# Altium project Gen_Ai_Kbd.PrjPcb (part 3 of 3)

## Sheet uController_n_Ethernet.SchDoc
size 594 x 420 mm; SheetNumber: 9; SheetTotal: 11; SPICEModelCacheEHICLKKR: <root> / <DocumentId>EHICLKKR</DocumentId> / <CacheFrame Number="0"> / <Model Name="0603_885012206095_100nf" Kind="CKT"> / <Text>******* / .subckt 0603_885012206095_100nF 1 2 / Rser 1 3 0.0157659152881 / Lser 2 4 3.10171966E-10 / C1 3 4 0.0000001 / Rpar 3 4 5000000000 / .ends 0603_885012206095_100nF</Text> / </Model> / <Model Name="0603_885012106006_10uf" Kind="CKT"> / <Text>******* / .subckt 0603_885012106006_10uF 1 2 / Rser 1 3 0.00407641026021 / Lser 2 4 4.16060333E-10 / C1 3 4 0.00001 / Rpar 3 4 5000000 / .ends 0603_885012106006_10uF</Text> / </Model> / </CacheFrame> / </root>
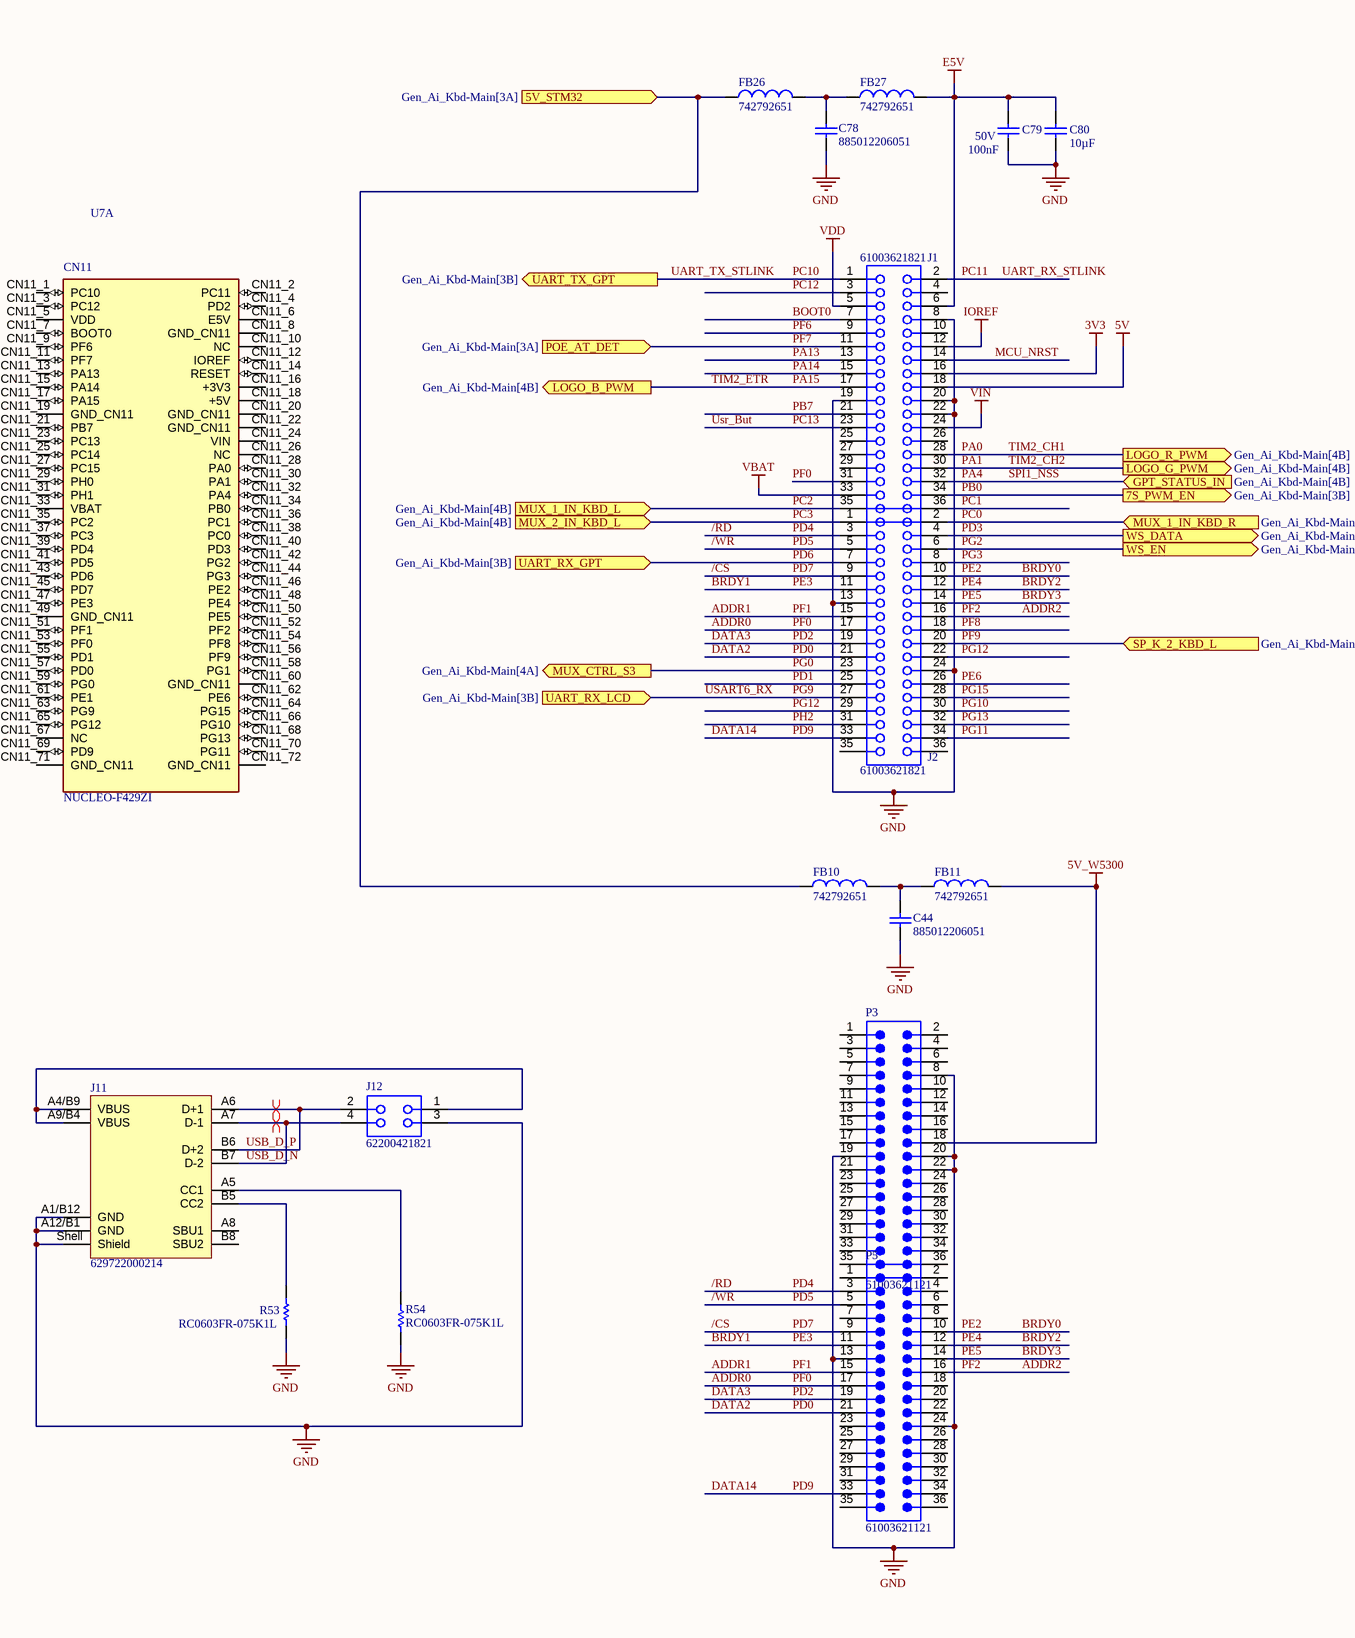
[diagram p8: uController_n_Ethernet.SchDoc, left]
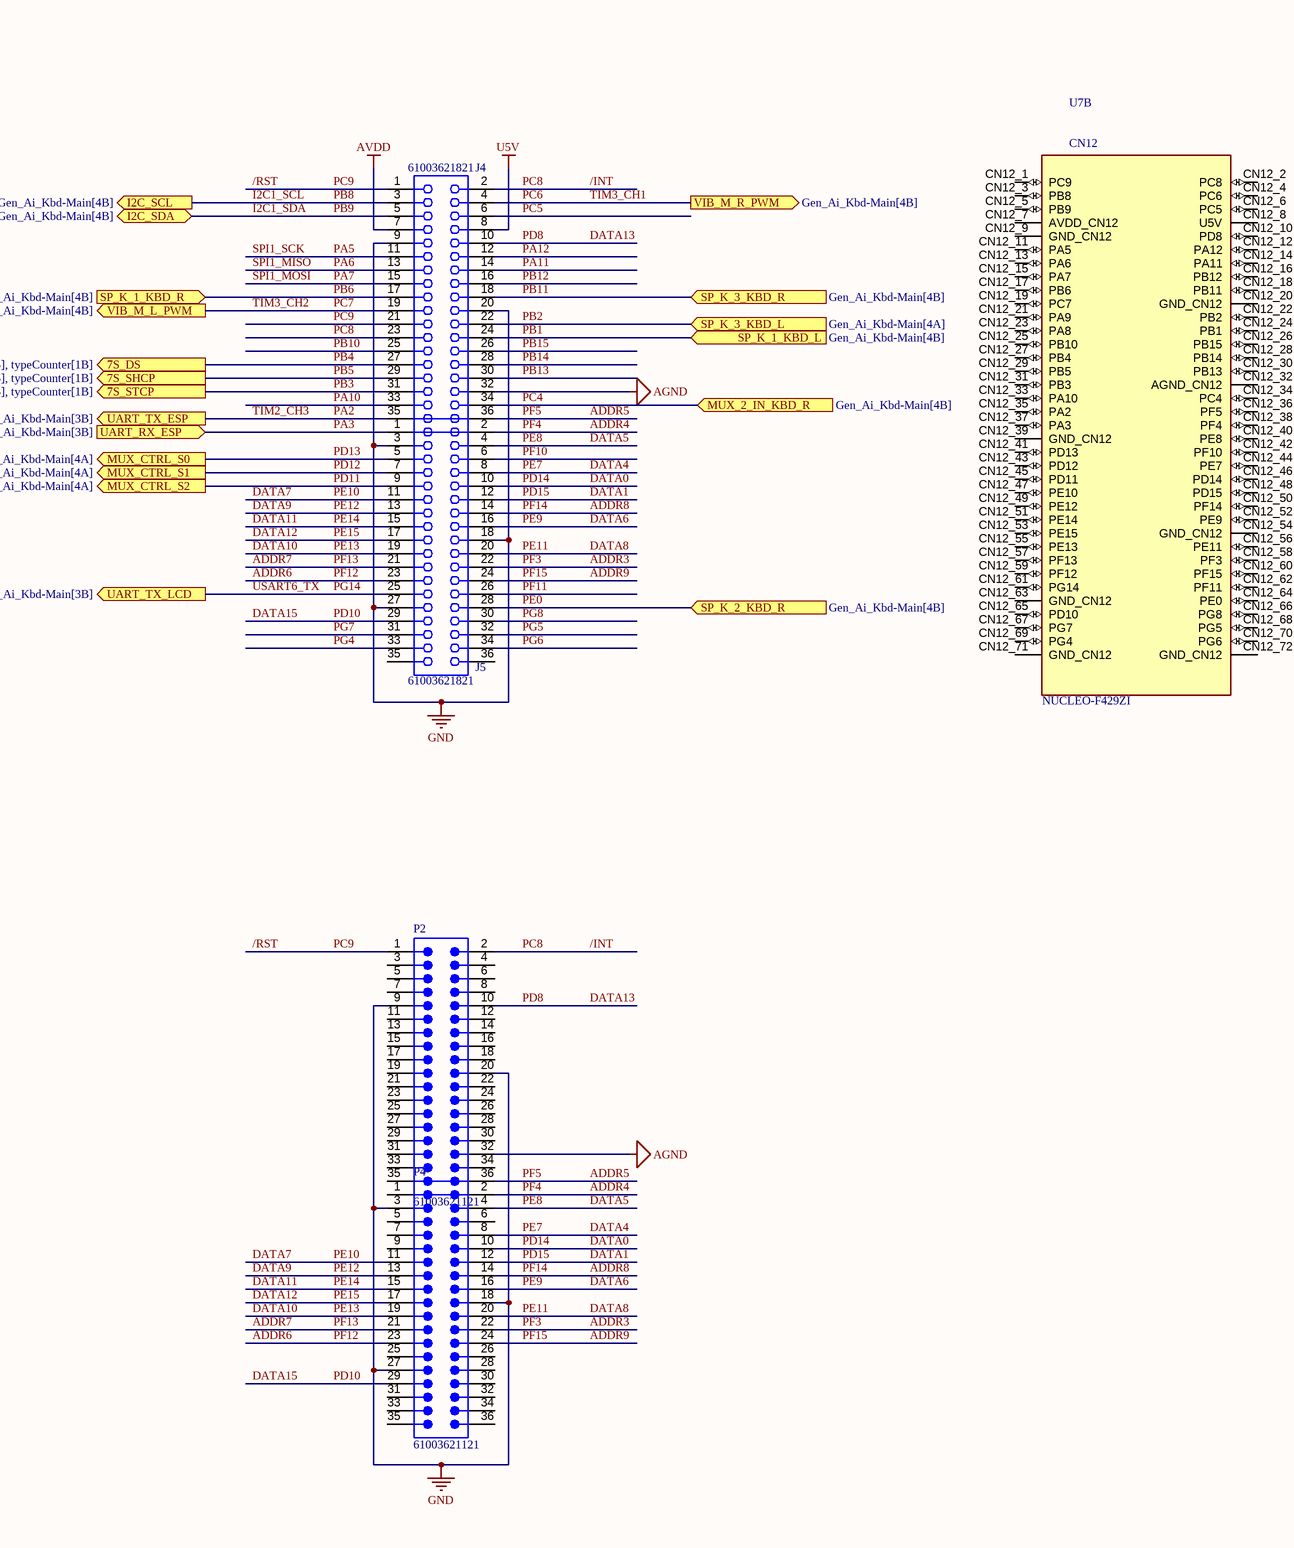
[diagram p9: uController_n_Ethernet.SchDoc, right]

### Parts
C44  885012206051  [WCAP-CSGP_0603_L1.6W0.8H0.8_Reflow]
C78  885012206051  [WCAP-CSGP_0603_L1.6W0.8H0.8_Reflow]
C79  Capacitance: 100nF  Rated Voltage (DC): 50V  [WCAP-CSGP_0603_L1.6W0.8H0.8_Reflow]  (hidden comment: 885012206095)
C80  Capacitance: 10µF  [WCAP-CSGP_0603_L1.6W0.8H0.8_Reflow]  (hidden comment: 885012106006)
FB10  742792651  [WE-CBF_0603_L1.6W0.8H0.8_HC]
FB11  742792651  [WE-CBF_0603_L1.6W0.8H0.8_HC]
FB26  742792651  [WE-CBF_0603_L1.6W0.8H0.8_HC]
FB27  742792651  [WE-CBF_0603_L1.6W0.8H0.8_HC]
J1  61003621821  [61003621821]
J2  61003621821  [61003621821]
J4  61003621821  [61003621821]
J5  61003621821  [61003621821]
J11  629722000214  [629722000214]
J12  62200421821  [62200421821]
P2  61003621121  [61003621121]
P3  61003621121  [61003621121]
P4  61003621121  [61003621121]
P5  61003621121  [61003621121]
R53  RC0603FR-075K1L  [RESC1608X55X25ML10T15]
R54  RC0603FR-075K1L  [RESC1608X55X25ML10T15]
U7  NUCLEO-F429ZI  [MODULE_NUCLEO-F429ZI]  (parts A,B of 6)

### Ports
5V_STM32 (in, see Gen_Ai_Kbd-Main[3A]), 7S_DS (out, see Gen_Ai_Kbd-Main[3B], typeCounter[1B]), 7S_PWM_EN (out, see Gen_Ai_Kbd-Main[3B]), 7S_SHCP (out, see Gen_Ai_Kbd-Main[3B], typeCounter[1B]), 7S_STCP (out, see Gen_Ai_Kbd-Main[3B], typeCounter[1B]), GPT_STATUS_IN (in, see Gen_Ai_Kbd-Main[4B]), I2C_SCL (out, see Gen_Ai_Kbd-Main[4B]), I2C_SDA (bidir, see Gen_Ai_Kbd-Main[4B]), LOGO_B_PWM (out, see Gen_Ai_Kbd-Main[4B]), LOGO_G_PWM (out, see Gen_Ai_Kbd-Main[4B]), LOGO_R_PWM (out, see Gen_Ai_Kbd-Main[4B]), MUX_1_IN_KBD_L (in, see Gen_Ai_Kbd-Main[4B]), MUX_1_IN_KBD_R (in, see Gen_Ai_Kbd-Main[4B]), MUX_2_IN_KBD_L (in, see Gen_Ai_Kbd-Main[4B]), MUX_2_IN_KBD_R (in, see Gen_Ai_Kbd-Main[4B]), MUX_CTRL_S0 (out, see Gen_Ai_Kbd-Main[4A]), MUX_CTRL_S1 (out, see Gen_Ai_Kbd-Main[4A]), MUX_CTRL_S2 (out, see Gen_Ai_Kbd-Main[4A]), MUX_CTRL_S3 (out, see Gen_Ai_Kbd-Main[4A]), POE_AT_DET (in, see Gen_Ai_Kbd-Main[3A]), SP_K_1_KBD_L (in, see Gen_Ai_Kbd-Main[4B]), SP_K_1_KBD_R (in, see Gen_Ai_Kbd-Main[4B]), SP_K_2_KBD_L (in, see Gen_Ai_Kbd-Main[4A]), SP_K_2_KBD_R (in, see Gen_Ai_Kbd-Main[4B]), SP_K_3_KBD_L (in, see Gen_Ai_Kbd-Main[4A]), SP_K_3_KBD_R (in, see Gen_Ai_Kbd-Main[4B]), UART_RX_ESP (in, see Gen_Ai_Kbd-Main[3B]), UART_RX_GPT (in, see Gen_Ai_Kbd-Main[3B]), UART_RX_LCD (in, see Gen_Ai_Kbd-Main[3B]), UART_TX_ESP (out, see Gen_Ai_Kbd-Main[3B]), UART_TX_GPT (out, see Gen_Ai_Kbd-Main[3B]), UART_TX_LCD (out, see Gen_Ai_Kbd-Main[3B]), VIB_M_L_PWM (out, see Gen_Ai_Kbd-Main[4B]), VIB_M_R_PWM (out, see Gen_Ai_Kbd-Main[4B]), WS_DATA (out, see Gen_Ai_Kbd-Main[3B]), WS_EN (out, see Gen_Ai_Kbd-Main[3B])

### Nets
3V3: J1.16
5V: J1.18
5V_W5300: FB11.2 P3.18
+5V_GLOBAL_BUS: FB10.1 FB26.1 ; port 5V_STM32
AGND: J4.32 P2.32
AVDD: J4.7
E5V: C79.2 C80.2 FB27.2 J1.6
GND: C44.1 C78.1 C79.1 C80.1 J1.8 J1.19 J1.20 J1.22 J2.13 J2.24 J4.9 J4.20 J5.3 J5.18 J5.27 J11.A1/B12(GND) J11.A12/B1(GND) J11.Shell(Shield) J12.3 P2.9 P2.20 P3.8 P3.19 P3.20 P3.22 P4.3 P4.18 P4.27 P5.13 P5.24 R53.1 R54.1
IOREF: J1.12
U5V: J4.8
VBAT: J1.33
VDD: J1.5
VIN: J1.24
/CS: J2.9 P5.9  [also labelled PD7]
/INT: J4.2 J4.23 P2.2  [also labelled PC8]
/RD: J2.3 P5.3  [also labelled PD4]
/RST: J4.1 J4.21 P2.1  [also labelled PC9]
/WR: J2.5 P5.5  [also labelled PD5]
ADDR0: J1.31 J2.17 P5.17  [also labelled PF0]
ADDR1: J2.15 P5.15  [also labelled PF1]
ADDR2: J2.16 P5.16  [also labelled PF2]
ADDR3: J5.22 P4.22  [also labelled PF3]
ADDR4: J5.2 P4.2  [also labelled PF4]
ADDR5: J4.36 P2.36  [also labelled PF5]
ADDR6: J5.23 P4.23  [also labelled PF12]
ADDR7: J5.21 P4.21  [also labelled PF13]
ADDR8: J5.14 P4.14  [also labelled PF14]
ADDR9: J5.24 P4.24  [also labelled PF15]
BOOT0: J1.7
BRDY0: J2.10 P5.10  [also labelled PE2]
BRDY1: J2.11 P5.11  [also labelled PE3]
BRDY2: J2.12 P5.12  [also labelled PE4]
BRDY3: J2.14 P5.14  [also labelled PE5]
DATA0: J5.10 P4.10  [also labelled PD14]
DATA1: J5.12 P4.12  [also labelled PD15]
DATA2: J2.21 P5.21  [also labelled PD0]
DATA3: J2.19 P5.19  [also labelled PD2]
DATA4: J5.8 P4.8  [also labelled PE7]
DATA5: J5.4 P4.4  [also labelled PE8]
DATA6: J5.16 P4.16  [also labelled PE9]
DATA7: J5.11 P4.11  [also labelled PE10]
DATA8: J5.20 P4.20  [also labelled PE11]
DATA9: J5.13 P4.13  [also labelled PE12]
DATA10: J5.19 P4.19  [also labelled PE13]
DATA11: J5.15 P4.15  [also labelled PE14]
DATA12: J5.17 P4.17  [also labelled PE15]
DATA13: J4.10 P2.10  [also labelled PD8]
DATA14: J2.33 P5.33  [also labelled PD9]
DATA15: J5.29 P4.29  [also labelled PD10]
I2C1_SCL: J4.3 ; port I2C_SCL  [also labelled PB8]
I2C1_SDA: J4.5 ; port I2C_SDA  [also labelled PB~{9}]
MCU_NRST: J1.14
PA0: J1.28 ; port LOGO_R_PWM  [also labelled TIM2_CH1]
PA1: J1.30 ; port LOGO_G_PWM  [also labelled TIM2_CH2]
PA2: J4.35 ; port UART_TX_ESP  [also labelled TIM2_CH3]
PA3: J5.1 ; port UART_RX_ESP
PA4: J1.32 ; port GPT_STATUS_IN  [also labelled SPI1_NSS]
PA5: J4.11  [also labelled SPI1_SCK]
PA6: J4.13  [also labelled SPI1_MISO]
PA7: J4.15  [also labelled SPI1_MOSI]
PA10: J4.33
PA11: J4.14
PA12: J4.12
PA13: J1.13
PA14: J1.15
PA15: J1.17 ; port LOGO_B_PWM  [also labelled TIM2_ETR]
PB0: J1.34 ; port 7S_PWM_EN
PB1: J4.24 ; port SP_K_1_KBD_L
PB2: J4.22 ; port SP_K_3_KBD_L
PB3: J4.31 ; port 7S_STCP
PB4: J4.27 ; port 7S_DS
PB5: J4.29 ; port 7S_SHCP
PB6: J4.17 ; port SP_K_1_KBD_R
PB7: J1.21
PB10: J4.25
PB11: J4.18 ; port SP_K_3_KBD_R
PB12: J4.16
PB13: J4.30
PB14: J4.28
PB15: J4.26
PC0: J2.2 ; port MUX_1_IN_KBD_R
PC1: J1.36
PC2: J1.35 ; port MUX_1_IN_KBD_L
PC3: J2.1 ; port MUX_2_IN_KBD_L
PC4: J4.34 ; port MUX_2_IN_KBD_R
PC5: J4.6
PC6: J4.4 ; port VIB_M_R_PWM  [also labelled TIM3_CH1]
PC7: J4.19 ; port VIB_M_L_PWM  [also labelled TIM3_CH2]
PC10: J1.1 ; port UART_TX_GPT  [also labelled UART_TX_STLINK]
PC11: J1.2  [also labelled UART_RX_STLINK]
PC12: J1.3
PC13: J1.23  [also labelled Usr_But]
PD1: J2.25
PD3: J2.4 ; port WS_DATA
PD6: J2.7 ; port UART_RX_GPT
PD11: J5.9 ; port MUX_CTRL_S2
PD12: J5.7 ; port MUX_CTRL_S1
PD13: J5.5 ; port MUX_CTRL_S0
PE0: J5.28 ; port SP_K_2_KBD_R
PE6: J2.26
PF6: J1.9
PF7: J1.11 ; port POE_AT_DET
PF8: J2.18
PF9: J2.20 ; port SP_K_2_KBD_L
PF10: J5.6
PF11: J5.26
PG0: J2.23 ; port MUX_CTRL_S3
PG2: J2.6 ; port WS_EN
PG3: J2.8
PG4: J5.33
PG5: J5.32
PG6: J5.34
PG7: J5.31
PG8: J5.30
PG9: J2.27 ; port UART_RX_LCD  [also labelled USART6_RX]
PG10: J2.30
PG11: J2.34
PG12: J2.22 J2.29
PG13: J2.32
PG14: J5.25 ; port UART_TX_LCD  [also labelled USART6_TX]
PG15: J2.28
PH2: J2.31
USB_D_N: J11.A7(D-1) J11.B7(D-2) J12.4
USB_D_P: J11.A6(D+1) J11.B6(D+2) J12.2
NetC44_2: C44.2 FB10.2 FB11.1
NetC78_2: C78.2 FB26.2 FB27.1
NetJ11_A4/B9: J11.A4/B9(VBUS) J11.A9/B4(VBUS) J12.1
NetJ11_A5: J11.A5(CC1) R54.2
NetJ11_B5: J11.B5(CC2) R53.2

Not connected (* = marked no-connect by the designer): J1 4 10 25 26 27 29; J2 35 36; J5 35 36; J11 A8(SBU1) B8(SBU2); P2 3 4 5 6 7 8 11 12 13 14 15 16 17 18 19 21 22 23 24 25 26 27 28 29 30 31 33 34 35; P3 1 2 3 4 5 6 7 9 10 11 12 13 14 15 16 17 21 23 24 25 26 27 28 29 30 31 32 33 34 35 36; P4 1 5 6 7 9 25 26 28 30 31 32 33 34 35 36; P5 1 2 4 6 7 8 18 20 22 23 25 26 27 28 29 30 31 32 34 35 36; U7 CN11_1(PC10) CN11_2(PC11) CN11_3(PC12) CN11_4(PD2) CN11_5(VDD) CN11_6(E5V) CN11_7(BOOT0) CN11_8(GND_CN11) CN11_9(PF6) CN11_10(NC) CN11_11(PF7) CN11_12(IOREF) CN11_13(PA13) CN11_14(RESET) CN11_15(PA14) CN11_16(+3V3) CN11_17(PA15) CN11_18(+5V) CN11_19(GND_CN11) CN11_20(GND_CN11) CN11_21(PB7) CN11_22(GND_CN11) CN11_23(PC13) CN11_24(VIN) CN11_25(PC14) CN11_26(NC) CN11_27(PC15) CN11_28(PA0) CN11_29(PH0) CN11_30(PA1) CN11_31(PH1) CN11_32(PA4) CN11_33(VBAT) CN11_34(PB0) CN11_35(PC2) CN11_36(PC1) CN11_37(PC3) CN11_38(PC0) CN11_39(PD4) CN11_40(PD3) CN11_41(PD5) CN11_42(PG2) CN11_43(PD6) CN11_44(PG3) CN11_45(PD7) CN11_46(PE2) CN11_47(PE3) CN11_48(PE4) CN11_49(GND_CN11) CN11_50(PE5) CN11_51(PF1) CN11_52(PF2) CN11_53(PF0) CN11_54(PF8) CN11_55(PD1) CN11_56(PF9) CN11_57(PD0) CN11_58(PG1) CN11_59(PG0) CN11_60(GND_CN11) CN11_61(PE1) CN11_62(PE6) CN11_63(PG9) CN11_64(PG15) CN11_65(PG12) CN11_66(PG10) CN11_67(NC) CN11_68(PG13) CN11_69(PD9) CN11_70(PG11) CN11_71(GND_CN11) CN11_72(GND_CN11) CN12_1(PC9) CN12_2(PC8) CN12_3(PB8) CN12_4(PC6) CN12_5(PB9) CN12_6(PC5) CN12_7(AVDD_CN12) CN12_8(U5V) CN12_9(GND_CN12) CN12_10(PD8) CN12_11(PA5) CN12_12(PA12) CN12_13(PA6) CN12_14(PA11) CN12_15(PA7) CN12_16(PB12) CN12_17(PB6) CN12_18(PB11) CN12_19(PC7) CN12_20(GND_CN12) CN12_21(PA9) CN12_22(PB2) CN12_23(PA8) CN12_24(PB1) CN12_25(PB10) CN12_26(PB15) CN12_27(PB4) CN12_28(PB14) CN12_29(PB5) CN12_30(PB13) CN12_31(PB3) CN12_32(AGND_CN12) CN12_33(PA10) CN12_34(PC4) CN12_35(PA2) CN12_36(PF5) CN12_37(PA3) CN12_38(PF4) CN12_39(GND_CN12) CN12_40(PE8) CN12_41(PD13) CN12_42(PF10) CN12_43(PD12) CN12_44(PE7) CN12_45(PD11) CN12_46(PD14) CN12_47(PE10) CN12_48(PD15) CN12_49(PE12) CN12_50(PF14) CN12_51(PE14) CN12_52(PE9) CN12_53(PE15) CN12_54(GND_CN12) CN12_55(PE13) CN12_56(PE11) CN12_57(PF13) CN12_58(PF3) CN12_59(PF12) CN12_60(PF15) CN12_61(PG14) CN12_62(PF11) CN12_63(GND_CN12) CN12_64(PE0) CN12_65(PD10) CN12_66(PG8) CN12_67(PG7) CN12_68(PG5) CN12_69(PG4) CN12_70(PG6) CN12_71(GND_CN12) CN12_72(GND_CN12)

### Layout directives
differential pair: USB_D_N, USB_D_P

### Notes on the sheet
- DWG NO:
- REV:
- REVISION
- DESCRIPTION
- DATE
- APPROVED
- PROJECT
- sumasta
- t
- PROJECT REVISION:
- TITLE
- DOCUMENT REVISION:
- DESIGN ITEM:
- SCALE:
- A2
- SIZE
- CAGE CODE
- FILE NAME
- DWG NO.
- SHEET
- OF
- REV
- (in symbol CMP-017-000000-2, part A) CN11
- (in symbol CMP-017-000000-2, part B) CN12

### Library data of the parts
C44 C78 = CMP-03913-53914760-1: 885012206051 Cap Cer 0.68UF 16V X7R 0603; Insulation Resistance: 700MΩ; Tolerance: 10%; Capacitance: 680nF; NexarPartId: 53914760; Dielectric: X7R; Max Operating Temperature: 125°C; Thickness: 939.8µm; Case Code (Imperial): 0603; Length: 1.6mm; RoHS: Compliant; Min Operating Temperature: -55°C; Width: 800µm; Mount: Surface Mount; Height: 800µm; Case/Package: 0603; Case Code (Metric): 1608; Voltage Rating (DC): 16V; Packaging: Tape & Reel (TR); Voltage Rating: 16V
C79 = CMP-007-000655-1: as C51-C54 on sheet Peripherals; Operating Temperature Max: 125°C; Category: Multilayer Ceramic Chip Capacitors; ComponentLink1Description: Website Link; Manufacturer Part Number: 885012206095; Pin Count: 2; Ceramic Type: X7R; Component Type: Standard; Mount: Surface Mount; Operating Temperature Min: -55°C; Source: WCAP-CSGP.SchLib; ComponentLink2URL: https://www.we-online.com/redexpert/spec/885012206095?ad; Packaging: Tape and Reel; Match Code: WCAP-CSGP; Width: 0.8mm; ComponentLink1URL: https://www.we-online.com/redexpert/article/885012206095?ad; Height: 0.8mm; Design Item ID: 885012206095; Length: 1.6mm; ComponentLink2Description: Datasheet Link
C80 = CMP-007-000403-1: WCAP-CSGP Multilayer Ceramic Chip Capacitor, General Purpose, size 0603, X5R, 10µF, 6.3VDC; Manufacturer: Wurth Elektronik; Rated Voltage (DC): 6.3V; Insulation Resistance: 0.01GO; Technical Reference: X5R0603106M6R3DFCT10000; Dissipation Factor: 10%; Case/Size Code: 0603; Capacitance Tolerance: +/-20%; Mount: Surface Mount; Packaging: Tape and Reel; ComponentLink1URL: https://www.we-online.com/redexpert/article/885012106006?ad; Height: 0.8mm; ComponentLink2URL: https://www.we-online.com/redexpert/spec/885012106006?ad; Category: Multilayer Ceramic Chip Capacitors; Operating Temperature Max: 85°C; Operating Temperature Min: -55°C; Source: WCAP-CSGP.SchLib; Match Code: WCAP-CSGP; Design Item ID: 885012106006; Ceramic Type: X5R; Manufacturer Part Number: 885012106006; Component Type: Standard; Pin Count: 2; Width: 0.8mm; ComponentLink2Description: Datasheet Link; ComponentLink1Description: Website Link; Length: 1.6mm
FB10 FB11 FB26 FB27 = CMP-0220-00181-3: as FB19-FB23 on sheet Peripherals; Case Code (Imperial): 0603; Lead Free: Lead Free; Current Rating: 1A; Height: 800µm; Min Operating Temperature: -55°C; Core Material: Ferrite; REACH SVHC: Unknown; Case/Package: 0603; Weight: 3.997283mg; Mount: Surface Mount; Termination: SMD/SMT; Case Code (Metric): 1608; DC Resistance (DCR): 200mΩ; Series Resistance: 200mΩ; Max Operating Temperature: 125°C; Width: 800µm; Length: 1.6mm; Max DC Current: 1A; RoHS: Compliant; Material: Ferrite; Max Current Rating: 1A; Depth: 800µm; Packaging: Cut Tape (CT)
J1 J2 J4 J5 = CMP-1502-01300-2: NexarPartId: 65162132; Operating Supply Voltage: 250V; Contact Resistance: 20mΩ; Gender: Female; Current Rating: 3A; Lead Pitch: 2.54mm; Number of Pins: 36; Orientation: Vertical
J11 = CMP-207978-000003-2: Conenctor USB 2.0 Type C Horizontal SMT; NexarPartId: 129483980; USB Standard: USB 2.0; Gender: Receptacle; Current Rating: 5A; Insulation Resistance: 100MΩ; Pin Length: 950µm; Voltage Rating: 20V; Number of Contacts: 12; Height: 3.51mm; Packaging: Tape and Reel; Number of Pins: 16; Min Operating Temperature: -40°C; Max Operating Temperature: 85°C; RoHS: Compliant; Contact Material: Gold, Nickel
J12 = CMP-1502-01179-2: NexarPartId: 65162209; Contact Resistance: 20mΩ; Gender: Female; Current Rating: 1A; Operating Supply Voltage: 250V; Lead Pitch: 1.27mm; Contact Material: Copper; RoHS: Non-Compliant; Number of Pins: 4; Orientation: Vertical
P2-P5 = CMP-1502-01049-2: NexarPartId: 32855447; Gender: Male; Number of Contacts: 36; Connector Type: Male Pin; Pitch: 2.54mm; Contact Resistance: 20mΩ; Operating Supply Voltage: 250V; Current Rating: 3A; Termination: Solder; Contact Mating Length: 5.9944mm; Number of Rows: 2; REACH SVHC: Unknown; Color: Black; Contact Plating: Gold; Number of Pins: 36; Lead Pitch: 2.54mm; Mount: Surface Mount; Contact Material: Copper; Orientation: Vertical; RoHS: Compliant; Row Spacing: 2.54mm; Number of Positions: 36
R53 R54 = CMP-2000-04091-1: Manufacturer: Yageo; Part Number: RC0603FR-075K1L
U7 = CMP-017-000000-2: STM32F429ZI, mbed-Enabled Development Nucleo-144 STM32F4 ARMÂ® CortexÂ®-M4 MCU 32-Bit Embedded Evaluation Board; MF: STMicroelectronics; Component Type: Standard; Check_prices: https://www.snapeda.com/parts/NUCLEO-F429ZI/STMicroelectronics/view-part/?ref=eda; SnapEDA_Link: https://www.snapeda.com/parts/NUCLEO-F429ZI/STMicroelectronics/view-part/?ref=snap; Price: None; Design Item ID: NUCLEO-F429ZI; Value: *; Package: None; Availability: In Stock; Purchase-URL: https://pricing.snapeda.com/search/part/NUCLEO-F429ZI/?ref=eda; Source: NUCLEO-F429ZI.SchLib; MP: NUCLEO-F429ZI; Pin Count: 244

## Sheet BluetoothHID.SchDoc
size 420 x 297 mm; SheetNumber: 3; SheetTotal: 11; SPICEModelCacheQTASARTU: <root> / <DocumentId>QTASARTU</DocumentId> / <CacheFrame Number="0"> / <Model Name="0603_885012206095_100nf" Kind="CKT"> / <Text>******* / .subckt 0603_885012206095_100nF 1 2 / Rser 1 3 0.0157659152881 / Lser 2 4 3.10171966E-10 / C1 3 4 0.0000001 / Rpar 3 4 5000000000 / .ends 0603_885012206095_100nF</Text> / </Model> / <Model Name="0603_885012106006_10uf" Kind="CKT"> / <Text>******* / .subckt 0603_885012106006_10uF 1 2 / Rser 1 3 0.00407641026021 / Lser 2 4 4.16060333E-10 / C1 3 4 0.00001 / Rpar 3 4 5000000 / .ends 0603_885012106006_10uF</Text> / </Model> / </CacheFrame> / </root>
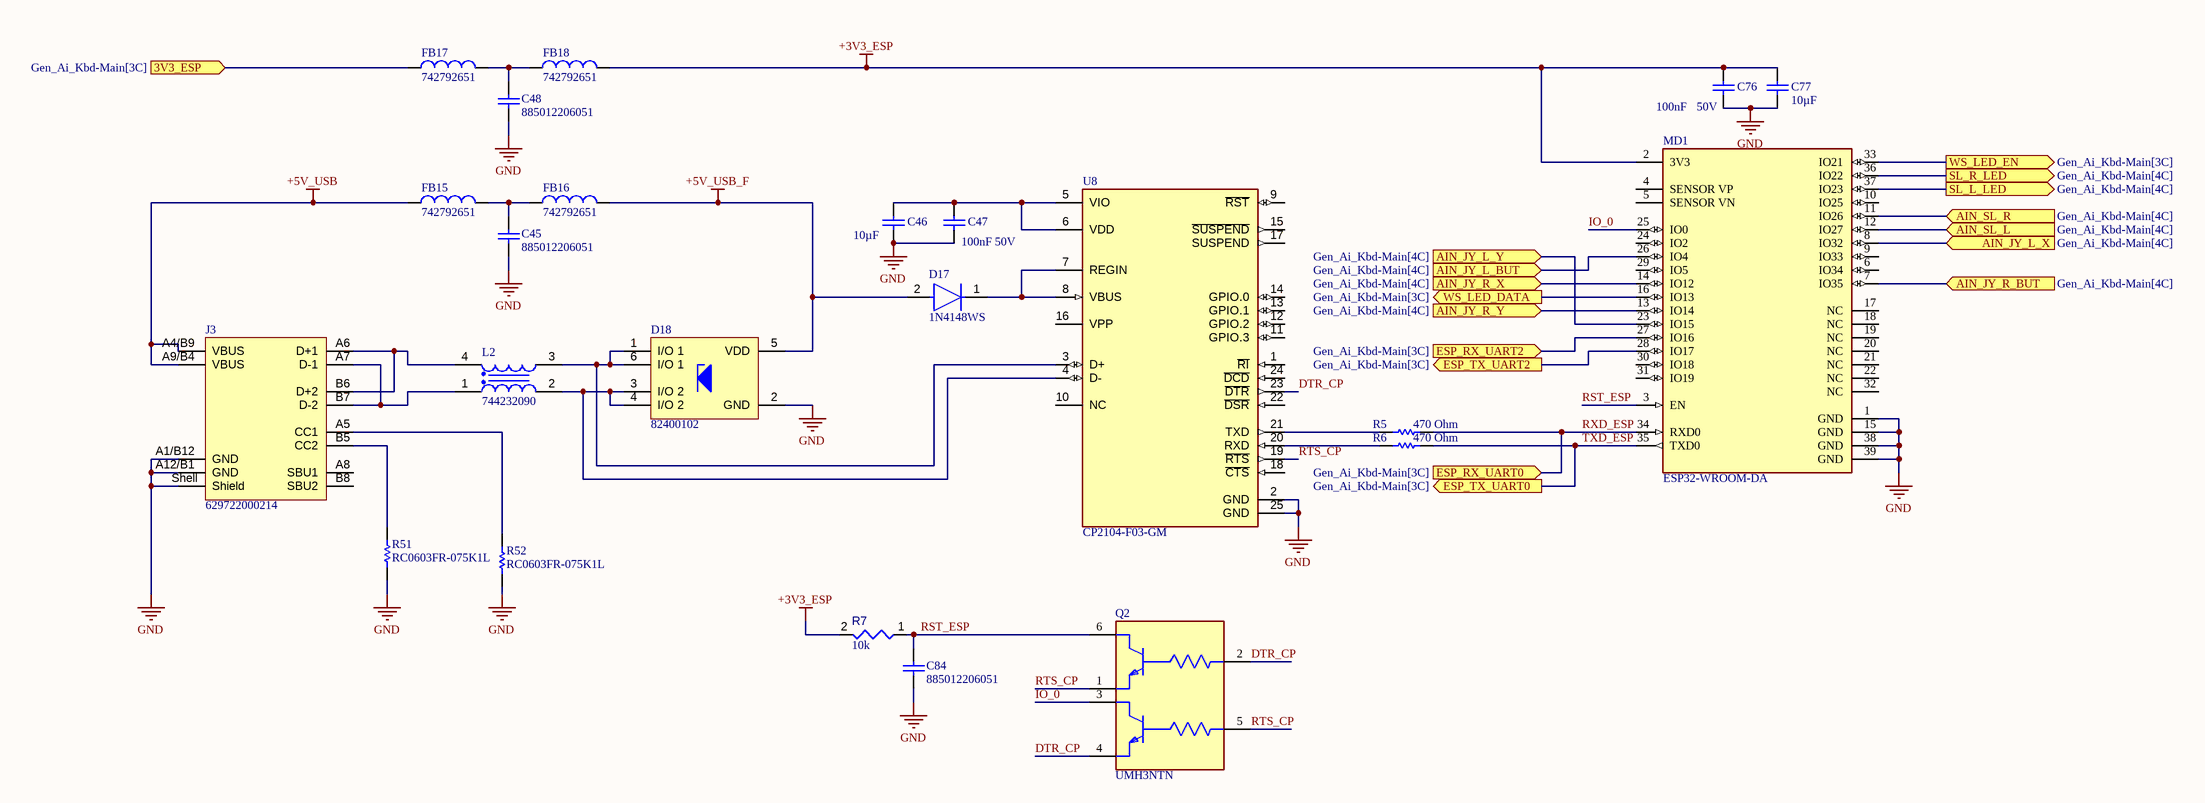
[diagram p10: BluetoothHID.SchDoc]

### Parts
C45  885012206051  [WCAP-CSGP_0603_L1.6W0.8H0.8_Reflow]
C46  Capacitance: 10µF  [WCAP-CSGP_0603_L1.6W0.8H0.8_Reflow]  (hidden comment: 885012106006)
C47  Capacitance: 100nF  Rated Voltage (DC): 50V  [WCAP-CSGP_0603_L1.6W0.8H0.8_Reflow]  (hidden comment: 885012206095)
C48  885012206051  [WCAP-CSGP_0603_L1.6W0.8H0.8_Reflow]
C76  Capacitance: 100nF  Rated Voltage (DC): 50V  [WCAP-CSGP_0603_L1.6W0.8H0.8_Reflow]  (hidden comment: 885012206095)
C77  Capacitance: 10µF  [WCAP-CSGP_0603_L1.6W0.8H0.8_Reflow]  (hidden comment: 885012106006)
C84  885012206051  [WCAP-CSGP_0603_L1.6W0.8H0.8_Reflow]
D17  1N4148WS  [FP-477AB-IPC_C]
D18  82400102  [WE-TVS_SOT23-6L]
FB15  742792651  [WE-CBF_0603_L1.6W0.8H0.8_HC]
FB16  742792651  [WE-CBF_0603_L1.6W0.8H0.8_HC]
FB17  742792651  [WE-CBF_0603_L1.6W0.8H0.8_HC]
FB18  742792651  [WE-CBF_0603_L1.6W0.8H0.8_HC]
J3  629722000214  [629722000214]
L2  744232090  [WE-CNSW_1206]
MD1  ESP32-WROOM-DA  [FP-ESP32-WROOM-DA]
Q2  UMH3NTN  [FP-UMT6-IPC_C]
R5  Resistance: 470 Ohm  [RESC1608X55X25LL10T15]  (hidden comment: RC0603FR-07470RL)
R6  Resistance: 470 Ohm  [RESC1608X55X25LL10T15]  (hidden comment: RC0603FR-07470RL)
R7  value 10k  [RESC1608X55X25ML10T15]  (hidden comment: Resistor 10k +/-1% 0603 100 mW)
R51  RC0603FR-075K1L  [RESC1608X55X25ML10T15]
R52  RC0603FR-075K1L  [RESC1608X55X25ML10T15]
U8  CP2104-F03-GM  [FP-CP2104-F03-GM-MFG]

### Ports
3V3_ESP (in, see Gen_Ai_Kbd-Main[3C]), AIN_JY_L_BUT (in, see Gen_Ai_Kbd-Main[4C]), AIN_JY_L_X (in, see Gen_Ai_Kbd-Main[4C]), AIN_JY_L_Y (in, see Gen_Ai_Kbd-Main[4C]), AIN_JY_R_BUT (in, see Gen_Ai_Kbd-Main[4C]), AIN_JY_R_X (in, see Gen_Ai_Kbd-Main[4C]), AIN_JY_R_Y (in, see Gen_Ai_Kbd-Main[4C]), AIN_SL_L (in, see Gen_Ai_Kbd-Main[4C]), AIN_SL_R (in, see Gen_Ai_Kbd-Main[4C]), ESP_RX_UART0 (in, see Gen_Ai_Kbd-Main[3C]), ESP_RX_UART2 (in, see Gen_Ai_Kbd-Main[3C]), ESP_TX_UART0 (out, see Gen_Ai_Kbd-Main[3C]), ESP_TX_UART2 (out, see Gen_Ai_Kbd-Main[3C]), SL_L_LED (out, see Gen_Ai_Kbd-Main[4C]), SL_R_LED (out, see Gen_Ai_Kbd-Main[4C]), WS_LED_DATA (out, see Gen_Ai_Kbd-Main[3C]), WS_LED_EN (out, see Gen_Ai_Kbd-Main[3C])

### Nets
+3V3_ESP: C76.2 C77.2 FB18.2 MD1.2(3V3) R7.2
+3V3_GLOBAL_BUS: FB17.1 ; port 3V3_ESP
+5V_USB: FB15.1 J3.A4/B9(VBUS) J3.A9/B4(VBUS)
+5V_USB_F: D17.2(A) D18.5(VDD) FB16.2
GND: C45.1 C46.1 C47.1 C48.1 C76.1 C77.1 C84.1 D18.2(GND) J3.A1/B12(GND) J3.A12/B1(GND) J3.Shell(Shield) MD1.1(GND) MD1.15(GND) MD1.38(GND) MD1.39(GND) R51.1 R52.1 U8.2(GND) U8.25(GND)
DTR_CP: Q2.2(B) Q2.4(E) U8.23(~{DTR})
IO_0: MD1.25(IO0) Q2.3(C)
PA2: MD1.27(IO16) ; port ESP_RX_UART2
PA3: MD1.28(IO17) ; port ESP_TX_UART2
RST_ESP: C84.2 MD1.3(EN) Q2.6(C) R7.1
RTS_CP: Q2.1(E) Q2.5(B) U8.19(~{RTS})
RXD_ESP: MD1.34(RXD0) R5.2 ; port ESP_RX_UART0
TXD_ESP: MD1.35(TXD0) R6.2 ; port ESP_TX_UART0  [project net PD6]
NetC45_2: C45.2 FB15.2 FB16.1
NetC46_2: C46.2 C47.2 U8.5(VIO) U8.6(VDD)
NetC48_2: C48.2 FB17.2 FB18.1
NetC51_1: MD1.8(IO32) ; port AIN_JY_L_X
NetC52_1: MD1.23(IO15) ; port AIN_JY_L_Y
NetC53_1: MD1.14(IO12) ; port AIN_JY_R_X
NetC54_1: MD1.13(IO14) ; port AIN_JY_R_Y
NetC71_1: MD1.12(IO27) ; port AIN_SL_L
NetC72_1: MD1.11(IO26) ; port AIN_SL_R
NetD17_1: D17.1(C) U8.7(REGIN) U8.8(VBUS)
NetD18_1: D18.1(I/O_1) D18.6(I/O_1) L2.3 U8.3(D+)
NetD18_3: D18.3(I/O_2) D18.4(I/O_2) L2.2 U8.4(D-)
NetJ3_A5: J3.A5(CC1) R52.2
NetJ3_A6: J3.A6(D+1) J3.B6(D+2) L2.4
NetJ3_A7: J3.A7(D-1) J3.B7(D-2) L2.1
NetJ3_B5: J3.B5(CC2) R51.2
NetMD1_7: MD1.7(IO35) ; port AIN_JY_R_BUT
NetMD1_16: MD1.16(IO13) ; port WS_LED_DATA
NetMD1_26: MD1.26(IO4) ; port AIN_JY_L_BUT
NetMD1_33: MD1.33(IO21) ; port WS_LED_EN
NetMD1_36: MD1.36(IO22) ; port SL_R_LED
NetMD1_37: MD1.37(IO23) ; port SL_L_LED
NetR5_1: R5.1 U8.21(TXD)
NetR6_1: R6.1 U8.20(RXD)

Not connected (* = marked no-connect by the designer): J3 A8(SBU1) B8(SBU2); MD1 4(SENSOR_VP) 5(SENSOR_VN) 6(IO34) 9(IO33) 10(IO25) 17(NC) 18(NC) 19(NC) 20(NC) 21(NC) 22(NC) 24(IO2) 29(IO5) 30(IO18) 31(IO19) 32(NC); U8 1(~{RI}) 9(~{RST}) 10(NC) 11(GPIO.3) 12(GPIO.2) 13(GPIO.1) 14(GPIO.0) 15(~{SUSPEND}) 16(VPP) 17(SUSPEND) 18(~{CTS}) 22(~{DSR}) 24(~{DCD})

### Notes on the sheet
- THIS DOCUMENT AND THE DATA DISCLOSED HEREIN OR
- HEREWITH IS THE PROPERTY OF SUMASTA TECH AND MAY
- DWG NO:
- REVISION
- REV:
- DESCRIPTION
- DATE
- APPROVED
- BE FREELY DISTRIBUTED IN WHOLE. NO RIGHTS ARE
- THIS DOCUMENT IS SUBJECT TO CHANGE WITHOUT NOTICE
- RESERVED OR EXPRESS OR IMPLIED WARANTEE GIVEN.
- PROJECT
- sumasta
- t
- PROJECT REVISION:
- TITLE
- DOCUMENT REVISION:
- DESIGN ITEM:
- SCALE:
- A3
- SIZE
- CAGE CODE
- FILE NAME
- DWG NO.
- SHEET
- OF
- REV

### Library data of the parts
C45 C48 C84 = CMP-03913-53914760-1: as C44 on sheet uController_n_Ethernet; NexarPartId: 53914760; Dielectric: X7R; Max Operating Temperature: 125°C; Thickness: 939.8µm; Case Code (Imperial): 0603; Length: 1.6mm; RoHS: Compliant; Min Operating Temperature: -55°C; Width: 800µm; Mount: Surface Mount; Height: 800µm; Case/Package: 0603; Case Code (Metric): 1608; Voltage Rating (DC): 16V; Packaging: Tape & Reel (TR); Voltage Rating: 16V
C46 C77 = CMP-007-000403-1: as C80 on sheet uController_n_Ethernet; Mount: Surface Mount; Packaging: Tape and Reel; ComponentLink1URL: https://www.we-online.com/redexpert/article/885012106006?ad; Height: 0.8mm; ComponentLink2URL: https://www.we-online.com/redexpert/spec/885012106006?ad; Category: Multilayer Ceramic Chip Capacitors; Operating Temperature Max: 85°C; Operating Temperature Min: -55°C; Source: WCAP-CSGP.SchLib; Match Code: WCAP-CSGP; Design Item ID: 885012106006; Ceramic Type: X5R; Manufacturer Part Number: 885012106006; Component Type: Standard; Pin Count: 2; Width: 0.8mm; ComponentLink2Description: Datasheet Link; ComponentLink1Description: Website Link; Length: 1.6mm
C47 C76 = CMP-007-000655-1: as C51-C54 on sheet Peripherals; Operating Temperature Max: 125°C; Category: Multilayer Ceramic Chip Capacitors; ComponentLink1Description: Website Link; Manufacturer Part Number: 885012206095; Pin Count: 2; Ceramic Type: X7R; Component Type: Standard; Mount: Surface Mount; Operating Temperature Min: -55°C; Source: WCAP-CSGP.SchLib; ComponentLink2URL: https://www.we-online.com/redexpert/spec/885012206095?ad; Packaging: Tape and Reel; Match Code: WCAP-CSGP; Width: 0.8mm; ComponentLink1URL: https://www.we-online.com/redexpert/article/885012206095?ad; Height: 0.8mm; Design Item ID: 885012206095; Length: 1.6mm; ComponentLink2Description: Datasheet Link
D17 = CMP-07163-000040-1: DIODE GEN PURP 75V 150MA SOD323F; Forward Voltage: 1V; Power Dissipation: 200mW; Element Configuration: Single; Max Forward Surge Current (Ifsm): 2A; Peak Reverse Current: 5uA; Recovery Time: 4ns; Package Quantity: 1; Number of Pins: 2; Height: 1mm; REACH SVHC: No SVHC; Max Reverse Voltage (DC): 75V; Forward Current: 150mA; Length: 1.8mm; Max Repetitive Reverse Voltage (Vrrm): 75V; Max Operating Temperature: 150°C; Average Rectified Current: 150mA; Contact Plating: Tin; Packaging: Tape and Reel; Radiation Hardening: No; Min Operating Temperature: -55°C; Width: 1.35mm; Weight: 0.0276g; Lead Free: Lead Free; Mount: Surface Mount; Reverse Voltage: 75V; Reverse Recovery Time: 4ns
D18 = CMP-1486-00007-2: NexarPartId: 22862942; Max Reverse Leakage Current: 5A; Test Current: 1mA; Number of Channels: 2; Leakage Current: 5µA; Min Breakdown Voltage: 6V; Working Voltage: 5V; Direction: Unidirectional; Max Surge Current: 6A; Element Configuration: Dual; ESD Protection: Yes; Capacitance: 2pF; Forward Voltage: 800mV; Polarity: Bidirectional; Clamping Voltage: 7.7V; RoHS: Compliant; Number of Bidirectional Channels: 2; Mount: Surface Mount; Number of Pins: 6; Case/Package: SOT-23; Length: 2.9mm; Min Operating Temperature: -55°C; REACH SVHC: Unknown; Max Operating Temperature: 125°C; Max Breakdown Voltage: 6V; Reverse Standoff Voltage: 5V; Width: 2.8mm; Breakdown Voltage: 6V; Height: 1.16mm; Termination: SMD/SMT; Power Line Protection: Yes; Operating Supply Voltage: 6V; Packaging: Digi-Reel®; Peak Pulse Current: 6A
FB15-FB18 = CMP-0220-00181-3: as FB19-FB23 on sheet Peripherals; Case Code (Imperial): 0603; Lead Free: Lead Free; Current Rating: 1A; Height: 800µm; Min Operating Temperature: -55°C; Core Material: Ferrite; REACH SVHC: Unknown; Case/Package: 0603; Weight: 3.997283mg; Mount: Surface Mount; Termination: SMD/SMT; Case Code (Metric): 1608; DC Resistance (DCR): 200mΩ; Series Resistance: 200mΩ; Max Operating Temperature: 125°C; Width: 800µm; Length: 1.6mm; Max DC Current: 1A; RoHS: Compliant; Material: Ferrite; Max Current Rating: 1A; Depth: 800µm; Packaging: Cut Tape (CT)
J3 = CMP-207978-000003-2: as J11 on sheet uController_n_Ethernet; Height: 3.51mm; Packaging: Tape and Reel; Number of Pins: 16; Min Operating Temperature: -40°C; Max Operating Temperature: 85°C; RoHS: Compliant; Contact Material: Gold, Nickel
L2 = CMP-0222-00035-2: NexarPartId: 7861718; Voltage Rating: 50V; Frequency: 100MHz; Max Current Rating: 370mA; Tolerance: 25%; Impedance: 90Ω; Core Material: Ferrite; Inductance: 111nH; Number of Lines: 2; DC Resistance (DCR): 300mΩ; Packaging: Digi-Reel®; REACH SVHC: No SVHC; Weight: 39.008944mg; Voltage Rating (AC): 50V; Max Operating Temperature: 125°C; Height: 1.8mm; Current: 370mA; RoHS: Compliant; Mount: Surface Mount; Min Operating Temperature: -40°C; Ambient Temperature Range Low: -40°C; Test Frequency: 100MHz; Width: 1.6mm; Ambient Temperature Range High: 85°C; Lead Free: Lead Free; Termination: SMD/SMT; Current Rating: 370mA; Voltage Rating (DC): 50V; Depth: 1.6mm; Number of Pins: 4; Length: 3.2mm; Resistance: 300mΩ; Max DC Current: 370mA; Case/Package: 1206
MD1 = CMP-021-00008-1: WiFi-Modul 802.11/BT 2, 4-2, 5GHz 150Mb/s, dual antenna
Q2 = CMP-08979-000010-1: TRANS 2NPN PREBIAS 0.15W UMT6; Transition Frequency: 250MHz; Collector Base Voltage (VCBO): 50V; Element Configuration: Dual; Emitter Base Voltage (VEBO): 5V; Max Collector Current: 100mA; Polarity: NPN; hFE Min: 100; Max Power Dissipation: 150mW; Collector-emitter Voltage-Max: 300mV; Collector Emitter Voltage (VCEO): 50V; Package Quantity: 1; Series: -; Case/Package: SOT-363; REACH SVHC: No SVHC; Number of Pins: 6; Operating Supply Voltage: 50V; Min Operating Temperature: -55°C; Mount: Surface Mount; Max Output Current: 100mA; Current Rating: 100mA; Lead Free: Lead Free; Continuous Collector Current: 100mA; Packaging: Tape and Reel; Max Operating Temperature: 150°C; Radiation Hardening: No; Max Breakdown Voltage: 50V; Voltage Rating (DC): 50V; Power Dissipation: 150mW; RoHS Compliant: Yes; Collector Emitter Breakdown Voltage: 50V
R5 R6 = CMP-1659-00035-2: General Purpose Chip Resistor, 470 Ohm, +/- 1%, -55 to 155 degC, 0603 (1608 Metric), RoHS, Tape and Reel; ComponentLink1Description: Manufacturer URL; Contact Plating: Gold; Width: 3.1 mm; Radiation Hardening: No; DatasheetVersion: Rev. 4, 04/2009; Length: 3 mm; PackageDescription: 2-Pin Surface Mount Device, Body 1.6 x 0.8 mm; ComponentLink1URL: http://www.yageo.com/; Min Operating Temperature: -40 degC; Mount: Surface Mount; Package Quantity: 2500; ComponentLink2URL: https://datasheet.ciiva.com/11808/0900766b80f96399-11808177.pdf; RoHSCompliant: true; Fastening Type: Snap; PackageReference: 0603; Max Operating Temperature: 90 degC; Height: 1.25 mm; Packaging: Tape and Reel; ComponentLink2Description: Datasheet; Contact Material: Brass
R7 = CMP-009-00017-5: as R10-R33 on sheet Peripherals; RoHS Compliant: True; Min Operating Temperature: -55°C; Pins: 2; Case/Package: 0603; Mounting Technology: SM; Max Operating Temperature: 155°C; Tolerance: 1%
R51 R52 = CMP-2000-04091-1: Manufacturer: Yageo; Part Number: RC0603FR-075K1L
U8 = CMP-0511-00004-2: IC SGL USB-TO-UART BRIDGE 24QFN; Number of Transceivers: 1; Max Supply Voltage: 3.6V; Operating Supply Current: 17mA; Operating Supply Voltage: 3.3V; Data Rate: 2Mbps; Min Supply Voltage: 3V; Number of Channels: 1; Max Operating Temperature: 85°C; Contact Plating: Tin; Min Operating Temperature: -40°C; Number of Pins: 24; Case/Package: QFN; Packaging: Rail/Tube; Radiation Hardening: No; Weight: 0.001764oz

## Sheet typeCounter.SchDoc
size 594 x 420 mm; SheetNumber: 10; SheetTotal: 11; SPICEModelCacheTYHCYEQT: <root> / <DocumentId>TYHCYEQT</DocumentId> / <CacheFrame Number="0"> / <Model Name="0603_885012206095_100nf" Kind="CKT"> / <Text>******* / .subckt 0603_885012206095_100nF 1 2 / Rser 1 3 0.0157659152881 / Lser 2 4 3.10171966E-10 / C1 3 4 0.0000001 / Rpar 3 4 5000000000 / .ends 0603_885012206095_100nF</Text> / </Model> / <Model Name="0603_885012106006_10uf" Kind="CKT"> / <Text>******* / .subckt 0603_885012106006_10uF 1 2 / Rser 1 3 0.00407641026021 / Lser 2 4 4.16060333E-10 / C1 3 4 0.00001 / Rpar 3 4 5000000 / .ends 0603_885012106006_10uF</Text> / </Model> / </CacheFrame> / </root>
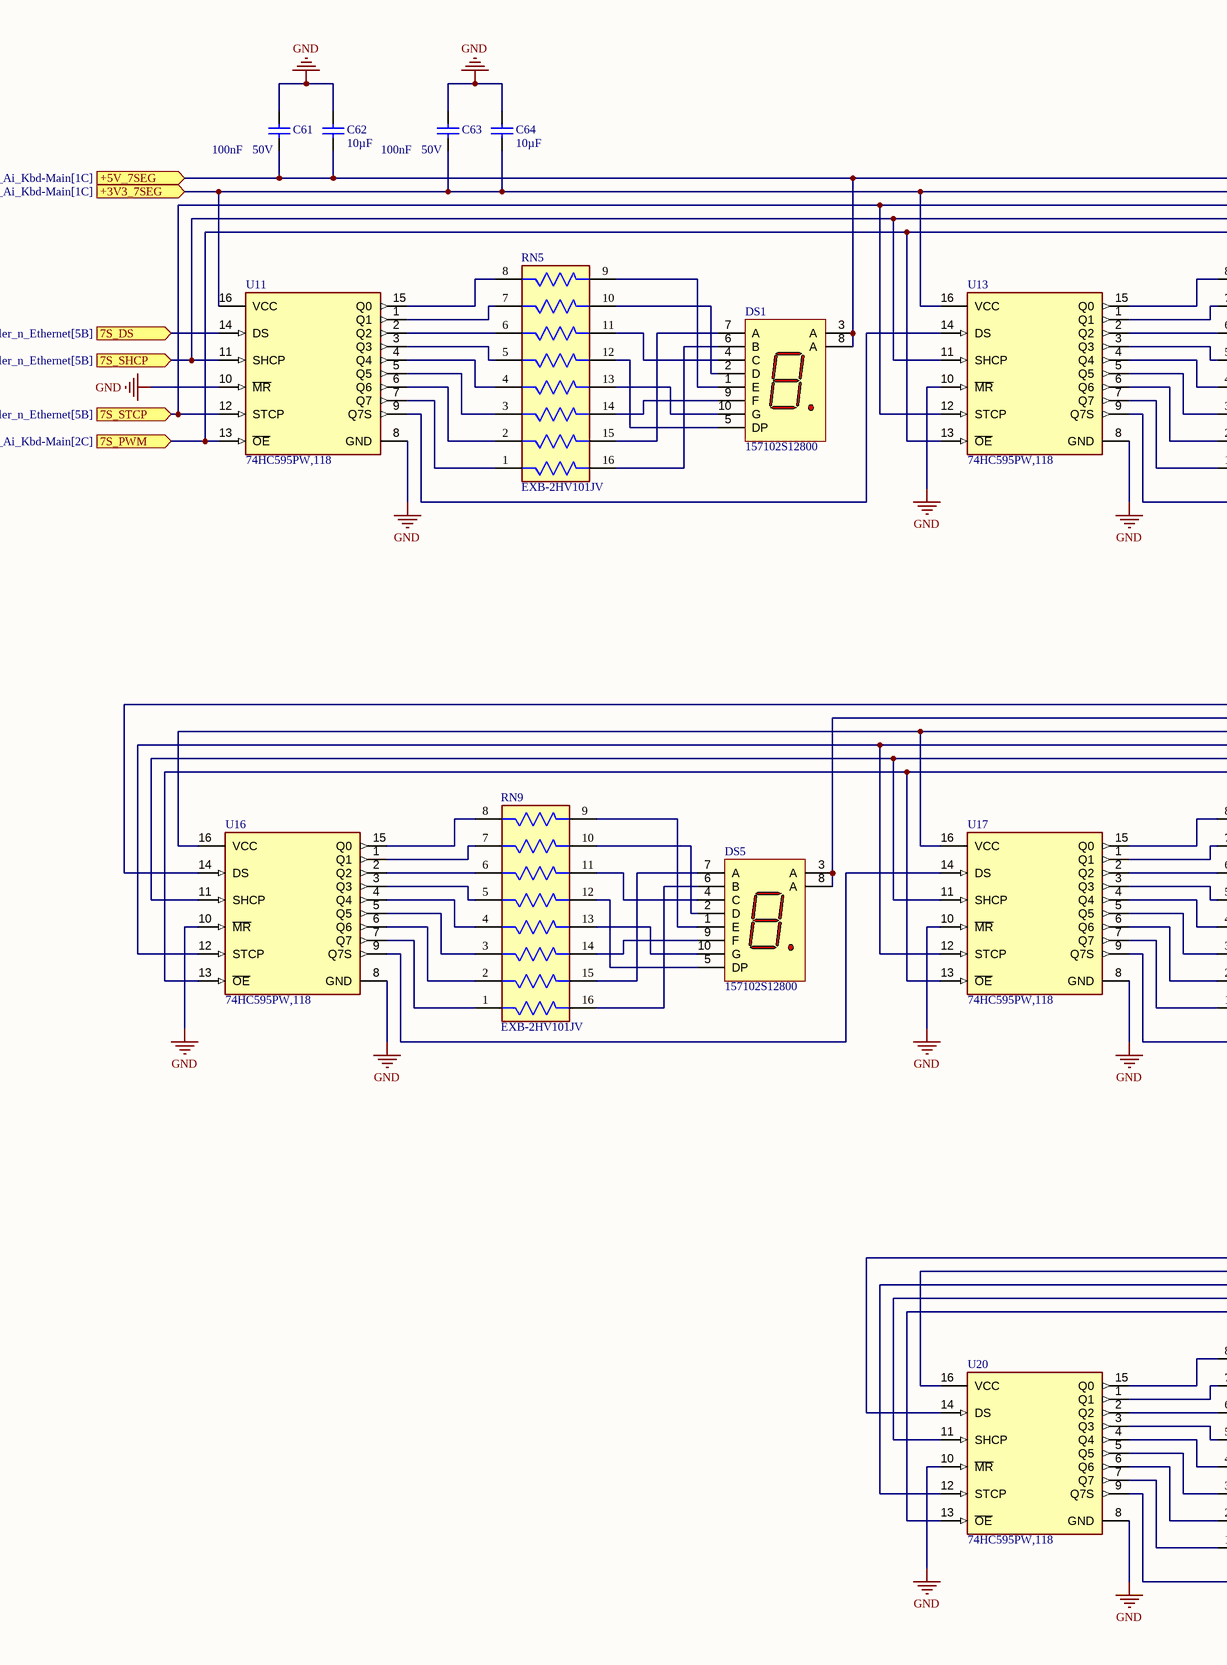
[diagram p11: typeCounter.SchDoc, left]
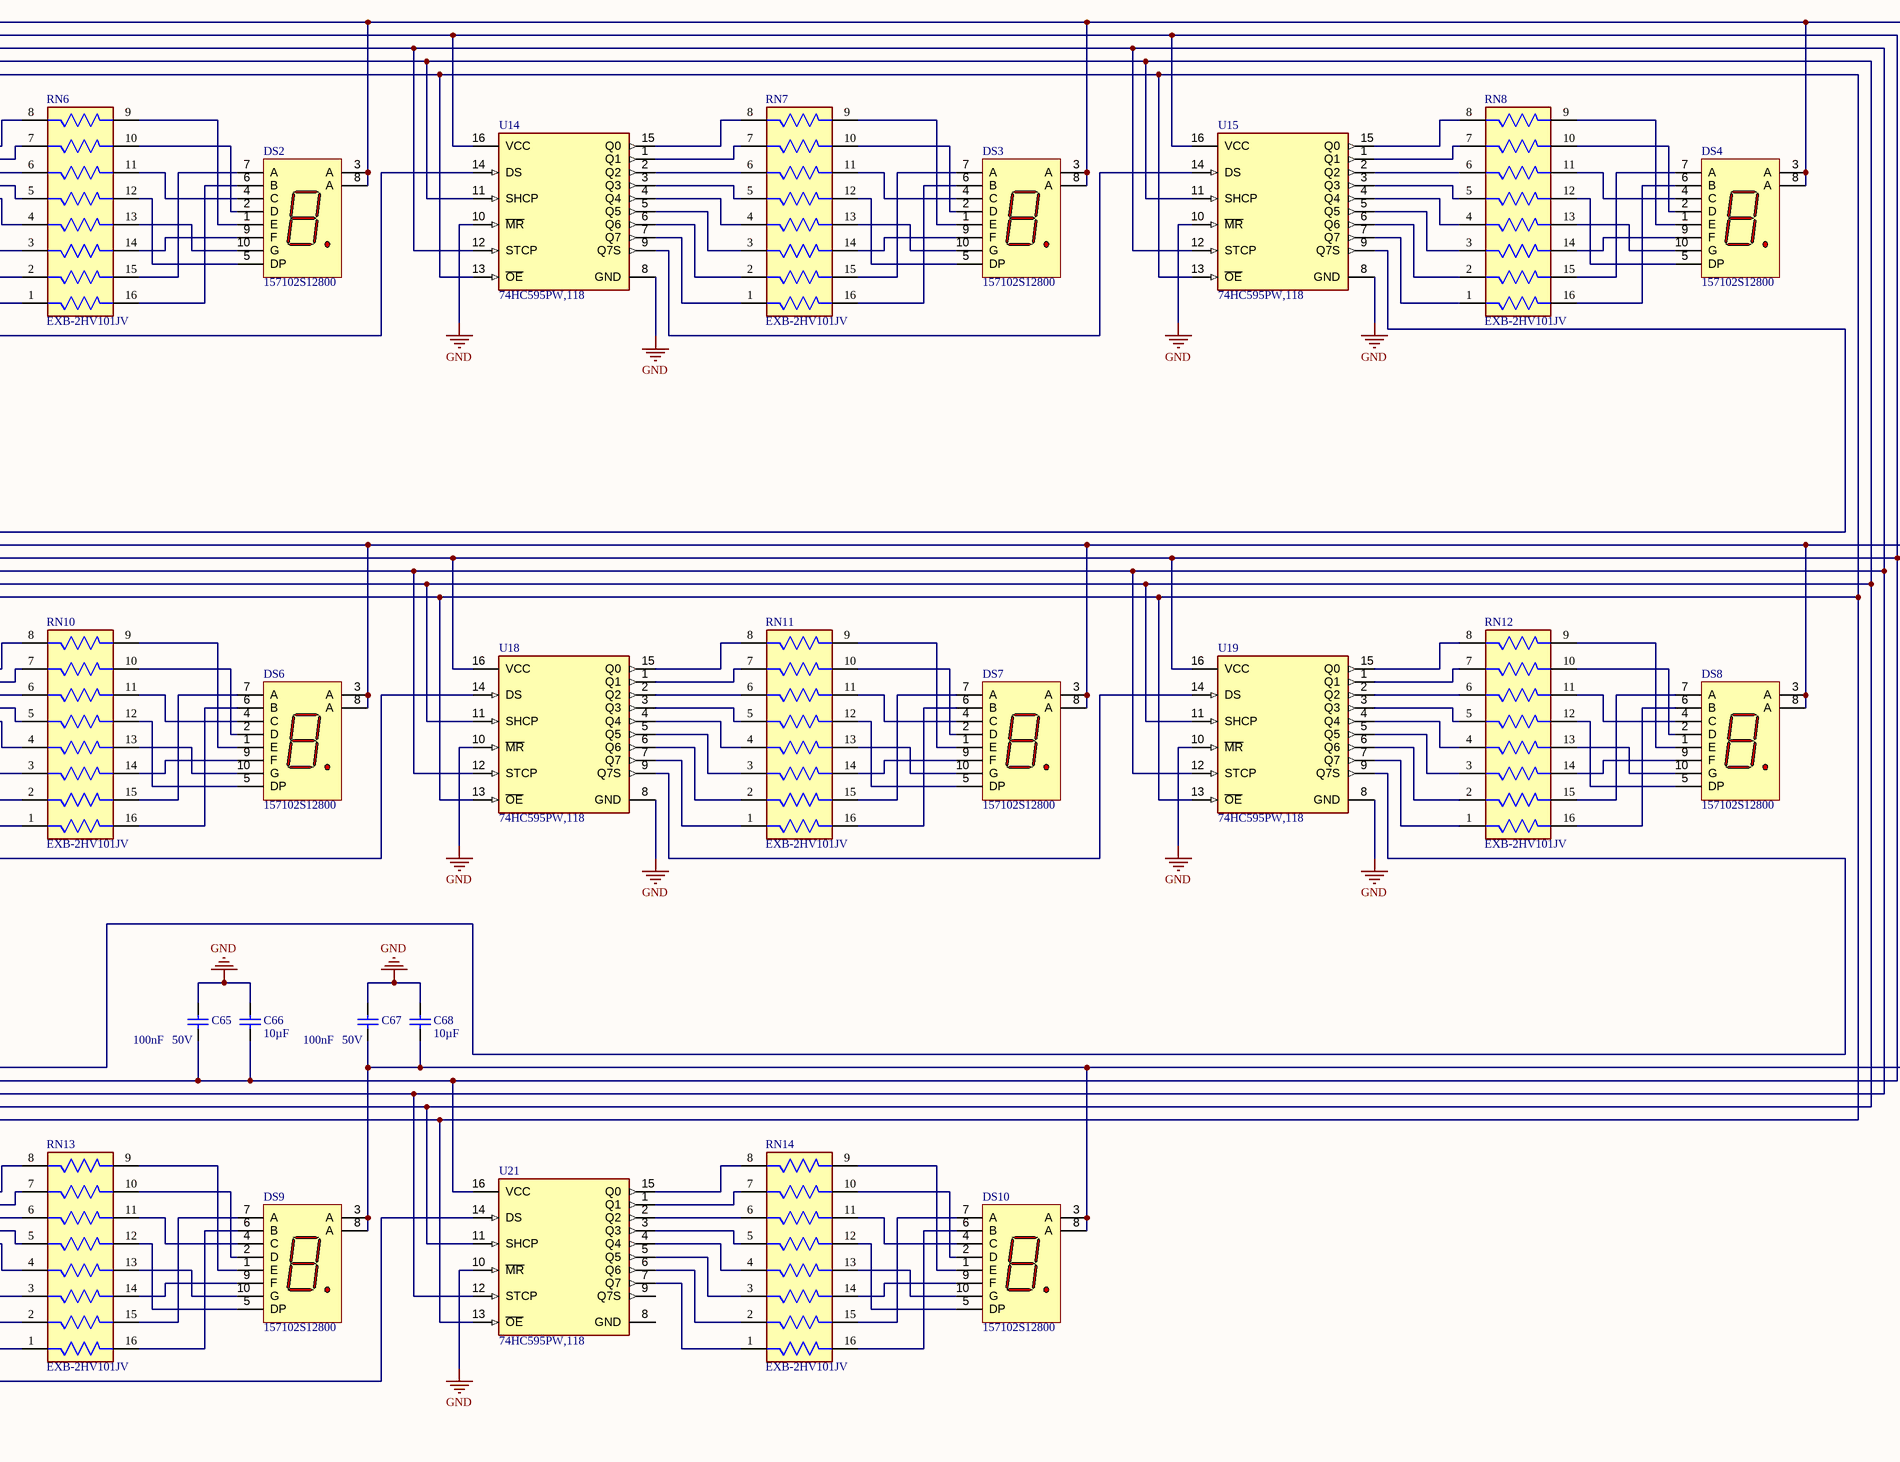
[diagram p12: typeCounter.SchDoc, right]

### Parts
C61  Capacitance: 100nF  Rated Voltage (DC): 50V  [WCAP-CSGP_0603_L1.6W0.8H0.8_Reflow]  (hidden comment: 885012206095)
C62  Capacitance: 10µF  [WCAP-CSGP_0603_L1.6W0.8H0.8_Reflow]  (hidden comment: 885012106006)
C63  Capacitance: 100nF  Rated Voltage (DC): 50V  [WCAP-CSGP_0603_L1.6W0.8H0.8_Reflow]  (hidden comment: 885012206095)
C64  Capacitance: 10µF  [WCAP-CSGP_0603_L1.6W0.8H0.8_Reflow]  (hidden comment: 885012106006)
C65  Capacitance: 100nF  Rated Voltage (DC): 50V  [WCAP-CSGP_0603_L1.6W0.8H0.8_Reflow]  (hidden comment: 885012206095)
C66  Capacitance: 10µF  [WCAP-CSGP_0603_L1.6W0.8H0.8_Reflow]  (hidden comment: 885012106006)
C67  Capacitance: 100nF  Rated Voltage (DC): 50V  [WCAP-CSGP_0603_L1.6W0.8H0.8_Reflow]  (hidden comment: 885012206095)
C68  Capacitance: 10µF  [WCAP-CSGP_0603_L1.6W0.8H0.8_Reflow]  (hidden comment: 885012106006)
DS1  157102S12800  [WL-S7DS_L10W6.9H3]
DS2  157102S12800  [WL-S7DS_L10W6.9H3]
DS3  157102S12800  [WL-S7DS_L10W6.9H3]
DS4  157102S12800  [WL-S7DS_L10W6.9H3]
DS5  157102S12800  [WL-S7DS_L10W6.9H3]
DS6  157102S12800  [WL-S7DS_L10W6.9H3]
DS7  157102S12800  [WL-S7DS_L10W6.9H3]
DS8  157102S12800  [WL-S7DS_L10W6.9H3]
DS9  157102S12800  [WL-S7DS_L10W6.9H3]
DS10  157102S12800  [WL-S7DS_L10W6.9H3]
RN5  EXB-2HV101JV  [FP-EXB2HV-MFG]
RN6  EXB-2HV101JV  [FP-EXB2HV-MFG]
RN7  EXB-2HV101JV  [FP-EXB2HV-MFG]
RN8  EXB-2HV101JV  [FP-EXB2HV-MFG]
RN9  EXB-2HV101JV  [FP-EXB2HV-MFG]
RN10  EXB-2HV101JV  [FP-EXB2HV-MFG]
RN11  EXB-2HV101JV  [FP-EXB2HV-MFG]
RN12  EXB-2HV101JV  [FP-EXB2HV-MFG]
RN13  EXB-2HV101JV  [FP-EXB2HV-MFG]
RN14  EXB-2HV101JV  [FP-EXB2HV-MFG]
U11  74HC595PW,118  [FP-SOT403-1-MFG]
U13  74HC595PW,118  [FP-SOT403-1-MFG]
U14  74HC595PW,118  [FP-SOT403-1-MFG]
U15  74HC595PW,118  [FP-SOT403-1-MFG]
U16  74HC595PW,118  [FP-SOT403-1-MFG]
U17  74HC595PW,118  [FP-SOT403-1-MFG]
U18  74HC595PW,118  [FP-SOT403-1-MFG]
U19  74HC595PW,118  [FP-SOT403-1-MFG]
U20  74HC595PW,118  [FP-SOT403-1-MFG]
U21  74HC595PW,118  [FP-SOT403-1-MFG]

### Ports
7S_DS (in, see Gen_Ai_Kbd-Main[2C], uController_n_Ethernet[5B]), 7S_PWM (in, see Gen_Ai_Kbd-Main[2C]), 7S_SHCP (in, see Gen_Ai_Kbd-Main[2C], uController_n_Ethernet[5B]), 7S_STCP (in, see Gen_Ai_Kbd-Main[2C], uController_n_Ethernet[5B]), +3V3_7SEG (in, see Gen_Ai_Kbd-Main[1C]), +5V_7SEG (in, see Gen_Ai_Kbd-Main[1C])

### Nets
+3V3_GLOBAL_BUS: C63.1 C64.1 C65.1 C66.1 U11.16(VCC) U13.16(VCC) U14.16(VCC) U15.16(VCC) U16.16(VCC) U17.16(VCC) U18.16(VCC) U19.16(VCC) U20.16(VCC) U21.16(VCC) ; port +3V3_7SEG
+5V_GLOBAL_BUS: C61.1 C62.1 C67.1 C68.1 DS1.3(A) DS1.8(A) DS2.3(A) DS2.8(A) DS3.3(A) DS3.8(A) DS4.3(A) DS4.8(A) DS5.3(A) DS5.8(A) DS6.3(A) DS6.8(A) DS7.3(A) DS7.8(A) DS8.3(A) DS8.8(A) DS9.3(A) DS9.8(A) DS10.3(A) DS10.8(A) ; port +5V_7SEG
GND: C61.2 C62.2 C63.2 C64.2 C65.2 C66.2 C67.2 C68.2 U11.8(GND) U11.10(~{MR}) U13.8(GND) U13.10(~{MR}) U14.8(GND) U14.10(~{MR}) U15.8(GND) U15.10(~{MR}) U16.8(GND) U16.10(~{MR}) U17.8(GND) U17.10(~{MR}) U18.8(GND) U18.10(~{MR}) U19.8(GND) U19.10(~{MR}) U20.8(GND) U20.10(~{MR}) U21.10(~{MR})
PB0: U11.13(~{OE}) U13.13(~{OE}) U14.13(~{OE}) U15.13(~{OE}) U16.13(~{OE}) U17.13(~{OE}) U18.13(~{OE}) U19.13(~{OE}) U20.13(~{OE}) U21.13(~{OE}) ; port 7S_PWM
PB3: U11.12(STCP) U13.12(STCP) U14.12(STCP) U15.12(STCP) U16.12(STCP) U17.12(STCP) U18.12(STCP) U19.12(STCP) U20.12(STCP) U21.12(STCP) ; port 7S_STCP
PB4: U11.14(DS) ; port 7S_DS
PB5: U11.11(SHCP) U13.11(SHCP) U14.11(SHCP) U15.11(SHCP) U16.11(SHCP) U17.11(SHCP) U18.11(SHCP) U19.11(SHCP) U20.11(SHCP) U21.11(SHCP) ; port 7S_SHCP
NetDS1_1: DS1.1(E) RN5.9
NetDS1_2: DS1.2(D) RN5.10
NetDS1_4: DS1.4(C) RN5.11
NetDS1_5: DS1.5(DP) RN5.12
NetDS1_6: DS1.6(B) RN5.16
NetDS1_7: DS1.7(A) RN5.15
NetDS1_9: DS1.9(F) RN5.14
NetDS1_10: DS1.10(G) RN5.13
NetDS2_1: DS2.1(E) RN6.9
NetDS2_2: DS2.2(D) RN6.10
NetDS2_4: DS2.4(C) RN6.11
NetDS2_5: DS2.5(DP) RN6.12
NetDS2_6: DS2.6(B) RN6.16
NetDS2_7: DS2.7(A) RN6.15
NetDS2_9: DS2.9(F) RN6.14
NetDS2_10: DS2.10(G) RN6.13
NetDS3_1: DS3.1(E) RN7.9
NetDS3_2: DS3.2(D) RN7.10
NetDS3_4: DS3.4(C) RN7.11
NetDS3_5: DS3.5(DP) RN7.12
NetDS3_6: DS3.6(B) RN7.16
NetDS3_7: DS3.7(A) RN7.15
NetDS3_9: DS3.9(F) RN7.14
NetDS3_10: DS3.10(G) RN7.13
NetDS4_1: DS4.1(E) RN8.9
NetDS4_2: DS4.2(D) RN8.10
NetDS4_4: DS4.4(C) RN8.11
NetDS4_5: DS4.5(DP) RN8.12
NetDS4_6: DS4.6(B) RN8.16
NetDS4_7: DS4.7(A) RN8.15
NetDS4_9: DS4.9(F) RN8.14
NetDS4_10: DS4.10(G) RN8.13
NetDS5_1: DS5.1(E) RN9.9
NetDS5_2: DS5.2(D) RN9.10
NetDS5_4: DS5.4(C) RN9.11
NetDS5_5: DS5.5(DP) RN9.12
NetDS5_6: DS5.6(B) RN9.16
NetDS5_7: DS5.7(A) RN9.15
NetDS5_9: DS5.9(F) RN9.14
NetDS5_10: DS5.10(G) RN9.13
NetDS6_1: DS6.1(E) RN10.9
NetDS6_2: DS6.2(D) RN10.10
NetDS6_4: DS6.4(C) RN10.11
NetDS6_5: DS6.5(DP) RN10.12
NetDS6_6: DS6.6(B) RN10.16
NetDS6_7: DS6.7(A) RN10.15
NetDS6_9: DS6.9(F) RN10.14
NetDS6_10: DS6.10(G) RN10.13
NetDS7_1: DS7.1(E) RN11.9
NetDS7_2: DS7.2(D) RN11.10
NetDS7_4: DS7.4(C) RN11.11
NetDS7_5: DS7.5(DP) RN11.12
NetDS7_6: DS7.6(B) RN11.16
NetDS7_7: DS7.7(A) RN11.15
NetDS7_9: DS7.9(F) RN11.14
NetDS7_10: DS7.10(G) RN11.13
NetDS8_1: DS8.1(E) RN12.9
NetDS8_2: DS8.2(D) RN12.10
NetDS8_4: DS8.4(C) RN12.11
NetDS8_5: DS8.5(DP) RN12.12
NetDS8_6: DS8.6(B) RN12.16
NetDS8_7: DS8.7(A) RN12.15
NetDS8_9: DS8.9(F) RN12.14
NetDS8_10: DS8.10(G) RN12.13
NetDS9_1: DS9.1(E) RN13.9
NetDS9_2: DS9.2(D) RN13.10
NetDS9_4: DS9.4(C) RN13.11
NetDS9_5: DS9.5(DP) RN13.12
NetDS9_6: DS9.6(B) RN13.16
NetDS9_7: DS9.7(A) RN13.15
NetDS9_9: DS9.9(F) RN13.14
NetDS9_10: DS9.10(G) RN13.13
NetDS10_1: DS10.1(E) RN14.9
NetDS10_2: DS10.2(D) RN14.10
NetDS10_4: DS10.4(C) RN14.11
NetDS10_5: DS10.5(DP) RN14.12
NetDS10_6: DS10.6(B) RN14.16
NetDS10_7: DS10.7(A) RN14.15
NetDS10_9: DS10.9(F) RN14.14
NetDS10_10: DS10.10(G) RN14.13
NetRN5_1: RN5.1 U11.7(Q7)
NetRN5_2: RN5.2 U11.6(Q6)
NetRN5_3: RN5.3 U11.5(Q5)
NetRN5_4: RN5.4 U11.4(Q4)
NetRN5_5: RN5.5 U11.3(Q3)
NetRN5_6: RN5.6 U11.2(Q2)
NetRN5_7: RN5.7 U11.1(Q1)
NetRN5_8: RN5.8 U11.15(Q0)
NetRN6_1: RN6.1 U13.7(Q7)
NetRN6_2: RN6.2 U13.6(Q6)
NetRN6_3: RN6.3 U13.5(Q5)
NetRN6_4: RN6.4 U13.4(Q4)
NetRN6_5: RN6.5 U13.3(Q3)
NetRN6_6: RN6.6 U13.2(Q2)
NetRN6_7: RN6.7 U13.1(Q1)
NetRN6_8: RN6.8 U13.15(Q0)
NetRN7_1: RN7.1 U14.7(Q7)
NetRN7_2: RN7.2 U14.6(Q6)
NetRN7_3: RN7.3 U14.5(Q5)
NetRN7_4: RN7.4 U14.4(Q4)
NetRN7_5: RN7.5 U14.3(Q3)
NetRN7_6: RN7.6 U14.2(Q2)
NetRN7_7: RN7.7 U14.1(Q1)
NetRN7_8: RN7.8 U14.15(Q0)
NetRN8_1: RN8.1 U15.7(Q7)
NetRN8_2: RN8.2 U15.6(Q6)
NetRN8_3: RN8.3 U15.5(Q5)
NetRN8_4: RN8.4 U15.4(Q4)
NetRN8_5: RN8.5 U15.3(Q3)
NetRN8_6: RN8.6 U15.2(Q2)
NetRN8_7: RN8.7 U15.1(Q1)
NetRN8_8: RN8.8 U15.15(Q0)
NetRN9_1: RN9.1 U16.7(Q7)
NetRN9_2: RN9.2 U16.6(Q6)
NetRN9_3: RN9.3 U16.5(Q5)
NetRN9_4: RN9.4 U16.4(Q4)
NetRN9_5: RN9.5 U16.3(Q3)
NetRN9_6: RN9.6 U16.2(Q2)
NetRN9_7: RN9.7 U16.1(Q1)
NetRN9_8: RN9.8 U16.15(Q0)
NetRN10_1: RN10.1 U17.7(Q7)
NetRN10_2: RN10.2 U17.6(Q6)
NetRN10_3: RN10.3 U17.5(Q5)
NetRN10_4: RN10.4 U17.4(Q4)
NetRN10_5: RN10.5 U17.3(Q3)
NetRN10_6: RN10.6 U17.2(Q2)
NetRN10_7: RN10.7 U17.1(Q1)
NetRN10_8: RN10.8 U17.15(Q0)
NetRN11_1: RN11.1 U18.7(Q7)
NetRN11_2: RN11.2 U18.6(Q6)
NetRN11_3: RN11.3 U18.5(Q5)
NetRN11_4: RN11.4 U18.4(Q4)
NetRN11_5: RN11.5 U18.3(Q3)
NetRN11_6: RN11.6 U18.2(Q2)
NetRN11_7: RN11.7 U18.1(Q1)
NetRN11_8: RN11.8 U18.15(Q0)
NetRN12_1: RN12.1 U19.7(Q7)
NetRN12_2: RN12.2 U19.6(Q6)
NetRN12_3: RN12.3 U19.5(Q5)
NetRN12_4: RN12.4 U19.4(Q4)
NetRN12_5: RN12.5 U19.3(Q3)
NetRN12_6: RN12.6 U19.2(Q2)
NetRN12_7: RN12.7 U19.1(Q1)
NetRN12_8: RN12.8 U19.15(Q0)
NetRN13_1: RN13.1 U20.7(Q7)
NetRN13_2: RN13.2 U20.6(Q6)
NetRN13_3: RN13.3 U20.5(Q5)
NetRN13_4: RN13.4 U20.4(Q4)
NetRN13_5: RN13.5 U20.3(Q3)
NetRN13_6: RN13.6 U20.2(Q2)
NetRN13_7: RN13.7 U20.1(Q1)
NetRN13_8: RN13.8 U20.15(Q0)
NetRN14_1: RN14.1 U21.7(Q7)
NetRN14_2: RN14.2 U21.6(Q6)
NetRN14_3: RN14.3 U21.5(Q5)
NetRN14_4: RN14.4 U21.4(Q4)
NetRN14_5: RN14.5 U21.3(Q3)
NetRN14_6: RN14.6 U21.2(Q2)
NetRN14_7: RN14.7 U21.1(Q1)
NetRN14_8: RN14.8 U21.15(Q0)
NetU11_9: U11.9(Q7S) U13.14(DS)
NetU13_9: U13.9(Q7S) U14.14(DS)
NetU14_9: U14.9(Q7S) U15.14(DS)
NetU15_9: U15.9(Q7S) U16.14(DS)
NetU16_9: U16.9(Q7S) U17.14(DS)
NetU17_9: U17.9(Q7S) U18.14(DS)
NetU18_9: U18.9(Q7S) U19.14(DS)
NetU19_9: U19.9(Q7S) U20.14(DS)
NetU20_9: U20.9(Q7S) U21.14(DS)

Not connected (* = marked no-connect by the designer): U21 8(GND) 9(Q7S)

### Notes on the sheet
- DWG NO:
- REV:
- REVISION
- DESCRIPTION
- DATE
- APPROVED
- PROJECT
- sumasta
- t
- PROJECT REVISION:
- TITLE
- DOCUMENT REVISION:
- DESIGN ITEM:
- SCALE:
- A2
- SIZE
- CAGE CODE
- FILE NAME
- DWG NO.
- SHEET
- OF
- REV

### Library data of the parts
C61 C63 C65 C67 = CMP-007-000655-1: as C51-C54 on sheet Peripherals; Operating Temperature Max: 125°C; Category: Multilayer Ceramic Chip Capacitors; ComponentLink1Description: Website Link; Manufacturer Part Number: 885012206095; Pin Count: 2; Ceramic Type: X7R; Component Type: Standard; Mount: Surface Mount; Operating Temperature Min: -55°C; Source: WCAP-CSGP.SchLib; ComponentLink2URL: https://www.we-online.com/redexpert/spec/885012206095?ad; Packaging: Tape and Reel; Match Code: WCAP-CSGP; Width: 0.8mm; ComponentLink1URL: https://www.we-online.com/redexpert/article/885012206095?ad; Height: 0.8mm; Design Item ID: 885012206095; Length: 1.6mm; ComponentLink2Description: Datasheet Link
C62 C64 C66 C68 = CMP-007-000403-1: as C80 on sheet uController_n_Ethernet; Mount: Surface Mount; Packaging: Tape and Reel; ComponentLink1URL: https://www.we-online.com/redexpert/article/885012106006?ad; Height: 0.8mm; ComponentLink2URL: https://www.we-online.com/redexpert/spec/885012106006?ad; Category: Multilayer Ceramic Chip Capacitors; Operating Temperature Max: 85°C; Operating Temperature Min: -55°C; Source: WCAP-CSGP.SchLib; Match Code: WCAP-CSGP; Design Item ID: 885012106006; Ceramic Type: X5R; Manufacturer Part Number: 885012106006; Component Type: Standard; Pin Count: 2; Width: 0.8mm; ComponentLink2Description: Datasheet Link; ComponentLink1Description: Website Link; Length: 1.6mm
DS1-DS10 = CMP-03913-133884679-1: 157102S12800 WL-S7DS 7 Segments Display SMT Single Digit; Luminous Intensity: 10mcd; Forward Current: 100mA; Max Reverse Voltage (DC): 5V; Dominant Wavelength: 635nm; Forward Voltage: 2V; RoHS: Compliant; Width: 6.9mm; Max Operating Temperature: 85°C; Length: 10mm; Min Operating Temperature: -35°C; NexarPartId: 133884679; Height: 3mm
RN5-RN14 = CMP-05421-000005-1: RES ARRAY 8 RES 100 OHM 1506; Temperature Coefficient: 200ppm/°C; Number of Contacts: 16; Power Per Element: 62.5mW; Power Rating: 250mW; Resistance Tolerance: 5%; Circuit Type: Isolated; Number of Resistors: 8; Voltage Rating: 25V; Power Dissipation: 63mW; Resistance: 100R; Voltage Rating (DC): 50V; Case/Package: 1506; Depth: 1.6mm; Thickness: 450um; Max Operating Temperature: 125°C; Mount: Surface Mount; Case Code (Imperial): 0402; Min Operating Temperature: -55°C; Termination: Convex; Packaging: Tape and Reel; Number of Terminals/Pins: 16; Technology: THICK FILM; Lead Free: Lead Free; Length: 3.8mm; Size Code: 0402; Tolerance: 5%; Number of Pins: 16; Series: EXB; Height: 0.022inch; Width: 0.063inch; Military Standard: Not; Terminal Pitch: 0.5mm; RoHS Compliant: Yes; Radiation Hardening: No; Case Code (Metric): 1005; REACH SVHC: No SVHC; Contact Plating: Tin; Package Quantity: 1; Number of Elements: 8
U11 U13-U21 = CMP-14351-000004-1: IC SHIFT REGISTER 8BIT 16TSSOP

## Sheet chatGPTInterlock.SchDoc
size 420 x 297 mm; SheetNumber: 11; SheetTotal: 11; SPICEModelCacheXTFIIDIY: <root> / <DocumentId>XTFIIDIY</DocumentId> / <CacheFrame Number="0"> / <Model Name="0603_885012206095_100nf" Kind="CKT"> / <Text>******* / .subckt 0603_885012206095_100nF 1 2 / Rser 1 3 0.0157659152881 / Lser 2 4 3.10171966E-10 / C1 3 4 0.0000001 / Rpar 3 4 5000000000 / .ends 0603_885012206095_100nF</Text> / </Model> / </CacheFrame> / </root>
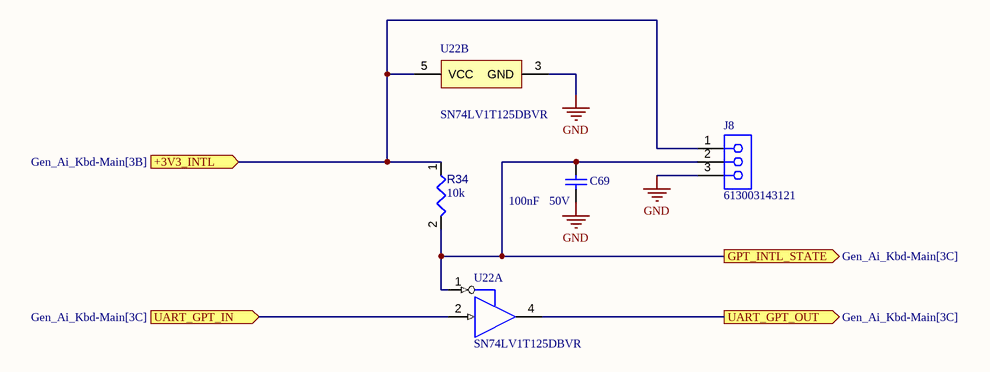
[diagram p13: chatGPTInterlock.SchDoc]

### Parts
C69  Capacitance: 100nF  Rated Voltage (DC): 50V  [WCAP-CSGP_0603_L1.6W0.8H0.8_Reflow]  (hidden comment: 885012206095)
J8  613003143121  [613003143121]
R34  value 10k  [RESC1608X55X25ML10T15]  (hidden comment: Resistor 10k +/-1% 0603 100 mW)
U22  SN74LV1T125DBVR  [DBV0005A_M]  (parts A,B of 2)

### Ports
+3V3_INTL (in, see Gen_Ai_Kbd-Main[3B]), GPT_INTL_STATE (out, see Gen_Ai_Kbd-Main[3C]), UART_GPT_IN (in, see Gen_Ai_Kbd-Main[3C]), UART_GPT_OUT (out, see Gen_Ai_Kbd-Main[3C])

### Nets
+3V3_GLOBAL_BUS: J8.1 R34.1 U22.5(VCC) ; port +3V3_INTL
GND: C69.1 J8.3 U22.3(GND)
PA4: C69.2 J8.2 R34.2 U22.1(~{OE}) ; port GPT_INTL_STATE
PC10: U22.2(A) ; port UART_GPT_IN
RXD_ESP: U22.4(Y) ; port UART_GPT_OUT

### Notes on the sheet
- THIS DOCUMENT AND THE DATA DISCLOSED HEREIN OR
- HEREWITH IS THE PROPERTY OF SUMASTA TECH AND MAY
- DWG NO:
- REVISION
- REV:
- DESCRIPTION
- DATE
- APPROVED
- BE FREELY DISTRIBUTED IN WHOLE. NO RIGHTS ARE
- THIS DOCUMENT IS SUBJECT TO CHANGE WITHOUT NOTICE
- RESERVED OR EXPRESS OR IMPLIED WARANTEE GIVEN.
- PROJECT
- sumasta
- t
- PROJECT REVISION:
- TITLE
- DOCUMENT REVISION:
- DESIGN ITEM:
- SCALE:
- A3
- SIZE
- CAGE CODE
- FILE NAME
- DWG NO.
- SHEET
- OF
- REV

### Library data of the parts
C69 = CMP-007-000655-1: as C51-C54 on sheet Peripherals; Operating Temperature Max: 125°C; Category: Multilayer Ceramic Chip Capacitors; ComponentLink1Description: Website Link; Manufacturer Part Number: 885012206095; Pin Count: 2; Ceramic Type: X7R; Component Type: Standard; Mount: Surface Mount; Operating Temperature Min: -55°C; Source: WCAP-CSGP.SchLib; ComponentLink2URL: https://www.we-online.com/redexpert/spec/885012206095?ad; Packaging: Tape and Reel; Match Code: WCAP-CSGP; Width: 0.8mm; ComponentLink1URL: https://www.we-online.com/redexpert/article/885012206095?ad; Height: 0.8mm; Design Item ID: 885012206095; Length: 1.6mm; ComponentLink2Description: Datasheet Link
J8 = CMP-1502-01406-2: NexarPartId: 61924711; Contact Resistance: 20mΩ; Operating Supply Voltage: 250V; Current Rating: 3A; Gender: Female; RoHS: Non-Compliant; Lead Pitch: 2.54mm; Number of Pins: 3
R34 = CMP-009-00017-5: as R10-R33 on sheet Peripherals; RoHS Compliant: True; Min Operating Temperature: -55°C; Pins: 2; Case/Package: 0603; Mounting Technology: SM; Max Operating Temperature: 155°C; Tolerance: 1%
U22 = CMP-0859-00122-3: Single Power Supply, Single BUFFER GATE w/ 3-State Output (active low enable), DBV0005A, LARGE T&R; Manufacturer: Texas Instruments; Schmitt Trigger: No; Sub-Family: Non-Inverting Buffer/Driver; Voltage(Nom)(V): 1.8,2.5,3.3,5.5; Output Drive (IOL/IOH)(Max)(mA): 8/-8; Bits(#): 1; Technology Family: LV1T; F @ Nom Voltage(Max)(Mhz): 50; Output Type: CMOS; Input Type: TTL; VCC(Min)(V): 1.6; tpd @ Nom Voltage(Max)(ns): 14.5,9.5,8.0,6.5; 3-State Output: Yes; ICC @ Nom Voltage(Max)(mA): 0.01; Rating: Catalog; Logic: True; Special Features: 1.8V to 3.3V Up Translation,3.3V to 1.8V Down Translation,5V Input Tolerant; VCC(Max)(V): 5.5; PackageReference: DBV0005A; Generic Part Number: SN74LV1T125; Operating Temperature Range(C): -40 to 125; DatasheetVersion: SCLS745A

## Nets that join several sheets
+3V3_GLOBAL_BUS: keyboard-Left (6 pins), keyboard-Right (6 pins), PoE (C10.1 C13.2 FB28.2 U6.3), Display (U25.5), Peripherals (7 pins), BluetoothHID (FB17.1), typeCounter (14 pins), chatGPTInterlock (J8.1 R34.1 U22.5)
+5V_GLOBAL_BUS: PoE (FB4.2 FB9.1 R9.1), Lights (L1.1), Display (FB24.1), uController_n_Ethernet (FB10.1 FB26.1), typeCounter (24 pins)
AGND: PoE (6 pins), uController_n_Ethernet (J4.32 P2.32)
GND: keyboard-Left (41 pins), keyboard-Right (41 pins), PoE (13 pins), Lights (125 pins), Display (8 pins), Peripherals (48 pins), uController_n_Ethernet (32 pins), BluetoothHID (19 pins), typeCounter (27 pins), chatGPTInterlock (C69.1 J8.3 U22.3)
I2C1_SCL: Peripherals (R30.1), uController_n_Ethernet (J4.3)
I2C1_SDA: Peripherals (R31.1), uController_n_Ethernet (J4.5)
NetC51_1: Peripherals (C51.1 R10.2), BluetoothHID (MD1.8)
NetC52_1: Peripherals (C52.1 R11.2), BluetoothHID (MD1.23)
NetC53_1: Peripherals (C53.1 R13.2), BluetoothHID (MD1.14)
NetC54_1: Peripherals (C54.1 R14.2), BluetoothHID (MD1.13)
NetC71_1: Peripherals (C71.1 R37.2), BluetoothHID (MD1.12)
NetC72_1: Peripherals (C72.1 R39.2), BluetoothHID (MD1.11)
NetMD1_7: Peripherals (R3.a R3.c), BluetoothHID (MD1.7)
NetMD1_16: Lights (U10.2), BluetoothHID (MD1.16)
NetMD1_26: Peripherals (R4.a R4.c), BluetoothHID (MD1.26)
NetMD1_33: Lights (U10.1), BluetoothHID (MD1.33)
NetMD1_36: Peripherals (R40.2), BluetoothHID (MD1.36)
NetMD1_37: Peripherals (R38.2), BluetoothHID (MD1.37)
PA0: Peripherals (R16.1 R19.1), uController_n_Ethernet (J1.28)
PA1: Peripherals (R15.1 R18.1), uController_n_Ethernet (J1.30)
PA2: uController_n_Ethernet (J4.35), BluetoothHID (MD1.27)
PA3: uController_n_Ethernet (J5.1), BluetoothHID (MD1.28)
PA4: uController_n_Ethernet (J1.32), chatGPTInterlock (C69.2 J8.2 R34.2 U22.1)
PA15: Peripherals (R12.1 R17.1), uController_n_Ethernet (J1.17)
PB0: uController_n_Ethernet (J1.34), typeCounter (10 pins)
PB1: keyboard-Left (SW35.2), uController_n_Ethernet (J4.24)
PB2: keyboard-Left (SW33.2), uController_n_Ethernet (J4.22)
PB3: uController_n_Ethernet (J4.31), typeCounter (10 pins)
PB4: uController_n_Ethernet (J4.27), typeCounter (U11.14)
PB5: uController_n_Ethernet (J4.29), typeCounter (10 pins)
PB6: keyboard-Right (SW70.2), uController_n_Ethernet (J4.17)
PB11: keyboard-Right (SW68.2), uController_n_Ethernet (J4.18)
PC0: keyboard-Right (R49.2 U4.1), uController_n_Ethernet (J2.2)
PC2: keyboard-Left (R47.2 U2.1), uController_n_Ethernet (J1.35)
PC3: keyboard-Left (R48.2 U3.1), uController_n_Ethernet (J2.1)
PC4: keyboard-Right (R50.2 U5.1), uController_n_Ethernet (J4.34)
PC6: Peripherals (R21.2), uController_n_Ethernet (J4.4)
PC7: Peripherals (R20.2), uController_n_Ethernet (J4.19)
PC10: uController_n_Ethernet (J1.1), chatGPTInterlock (U22.2)
PD3: Lights (U9.2), uController_n_Ethernet (J2.4)
PD6: uController_n_Ethernet (J2.7), BluetoothHID (MD1.35 R6.2)
PD11: keyboard-Left (RN1.3 RN2.3), keyboard-Right (RN3.3 RN4.3), uController_n_Ethernet (J5.9)
PD12: keyboard-Left (RN1.2 RN2.2), keyboard-Right (RN3.2 RN4.2), uController_n_Ethernet (J5.7)
PD13: keyboard-Left (RN1.1 RN2.1), keyboard-Right (RN3.1 RN4.1), uController_n_Ethernet (J5.5)
PE0: keyboard-Right (SW69.2), uController_n_Ethernet (J5.28)
PF7: PoE (FB5.2), uController_n_Ethernet (J1.11)
PF9: keyboard-Left (SW34.2), uController_n_Ethernet (J2.20)
PG0: keyboard-Left (RN1.4 RN2.4), keyboard-Right (RN3.4 RN4.4), uController_n_Ethernet (J2.23)
PG2: Lights (U9.1), uController_n_Ethernet (J2.6)
PG9: Display (U25.4), uController_n_Ethernet (J2.27)
PG14: Display (U24.2), uController_n_Ethernet (J5.25)
RXD_ESP: BluetoothHID (MD1.34 R5.2), chatGPTInterlock (U22.4)